# EAGLE design Alight_main_board_v2 (EAGLE 7.6.0)
CNAME: Alarm Light Main board / Juraj Repcik; CREVISION: 02

## Sheet 1 of 3
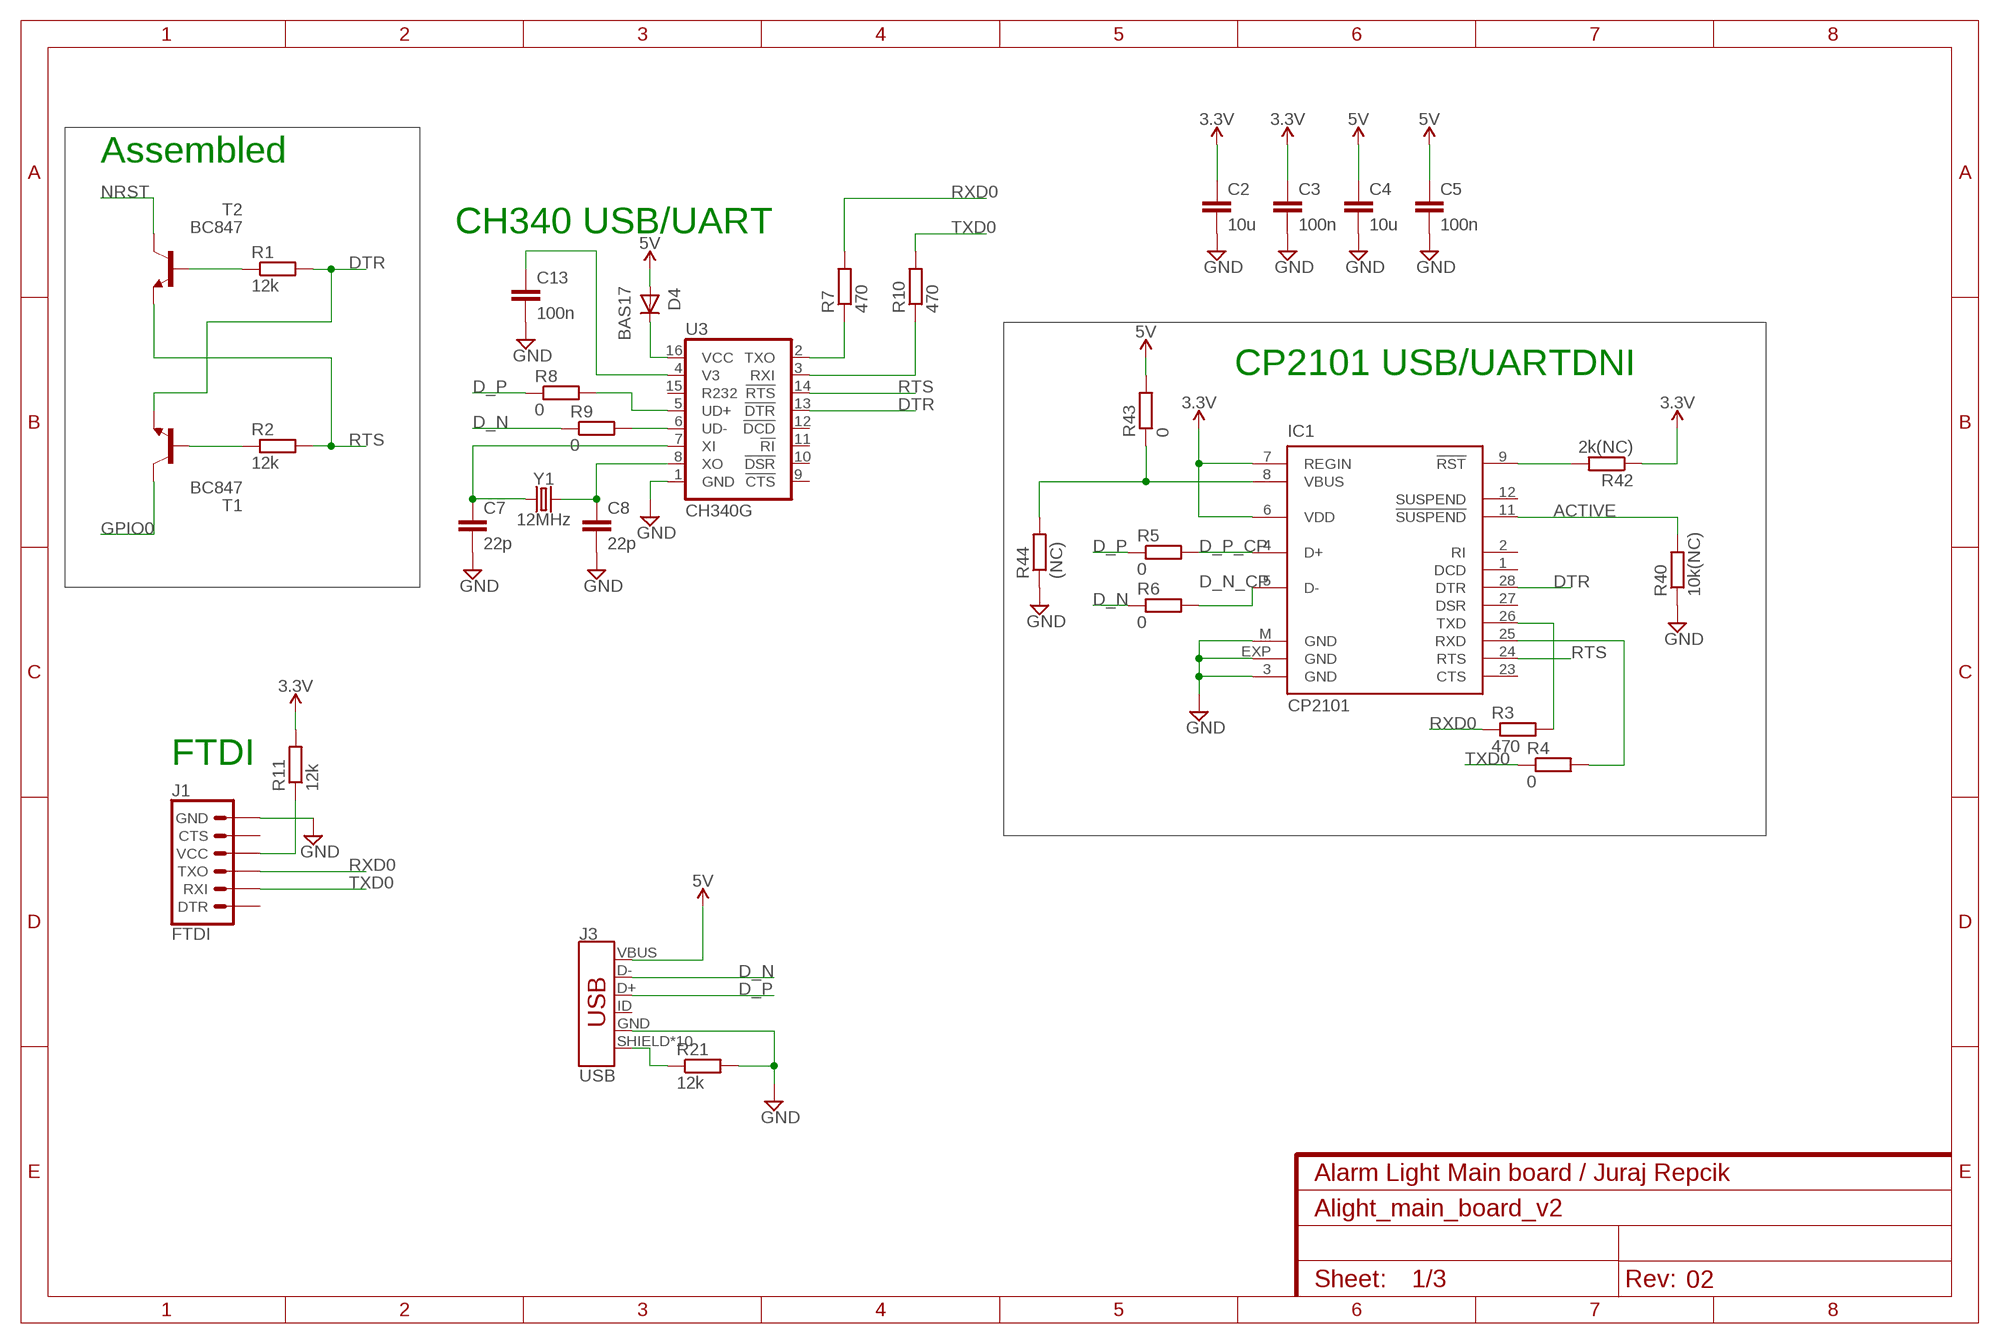
[diagram p0: schematic, sheet 1]

### Parts
C2  10u  C-EUC0603K  [C0603K]
C3  100n  C-EUC0603K  [C0603K]
C4  10u  C-EUC0603K  [C0603K]
C5  100n  C-EUC0603K  [C0603K]
C7  22p  C-EUC0402  [C0402]
C8  22p  C-EUC0402  [C0402]
C13  100n  C-EUC0603K  [C0603K]
D4  BAS17  [SOT23]
IC1  CP2101  CP210X_USB_UART  [MLP28]
J1  FTDI  6_PIN_SERIAL_TARGETLONGPADS  [1X06_LONGPADS]
J3  USB  USB_MICRO-B_HALF_PTH_MILL  [USB-MICROB-PTH-MILL]
R1  12k  R-EU_R0603  [R0603]
R2  12k  R-EU_R0603  [R0603]
R3  470  R-EU_R0603  [R0603]
R4  0  R-EU_R0603  [R0603]
R5  0  R-EU_R0603  [R0603]
R6  0  R-EU_R0603  [R0603]
R7  470  R-EU_R0603  [R0603]
R8  0  R-EU_R0603  [R0603]
R9  0  R-EU_R0603  [R0603]
R10  470  R-EU_R0603  [R0603]
R11  12k  R-EU_R0603  [R0603]
R21  12k  R-EU_R0603  [R0603]
R40  10k(NC)  R-EU_R0603  [R0603]
R42  2k(NC)  R-EU_R0603  [R0603]
R43  0  R-EU_R0603  [R0603]
R44  (NC)  R-EU_R0603  [R0603]
T1  BC847  [SOT23]
T2  BC847  [SOT23]
U3  CH340G  CH340GSMD  [SO016]
Y1  12MHz  CRYSTALSMD-HC49UP  [HC49UP]

### Nets
3.3V: C2.1 C3.1 IC1.6(VDD) IC1.7(REGIN) R11.2 R42.1 ; also sheet 2,3
5V: C4.1 C5.1 D4.1(A) J3.VBUS R43.2 ; also sheet 2,3
ACTIVE: IC1.11(!SUSPEND) R40.2
D_N: J3.D- R6.1 R9.1
D_N_CP: IC1.5(D-) R6.2
D_P: J3.D+ R5.1 R8.1
D_P_CP: IC1.4(D+) R5.2
DTR: IC1.28(DTR) R1.2 T1.2(E) U3.13(!DTR)
GND: C2.2 C3.2 C4.2 C5.2 C7.2 C8.2 C13.2 IC1.3(GND) IC1.EXP(GND) IC1.M(GND) J1.6(GND) J3.GND R21.2 R40.1 R44.1 U3.1(GND) ; also sheet 2,3
GPIO0: T1.3(C) ; also sheet 2
N$1: R1.1 T2.1(B)
N$2: R2.1 T1.1(B)
N$4: R7.1 U3.2(TXO)
N$5: R10.1 U3.3(RXI)
N$6: R8.2 U3.5(UD+)
N$7: R9.2 U3.6(UD-)
N$8: C7.1 U3.7(XI) Y1.1
N$9: C13.1 U3.4(V3)
N$10: C8.1 U3.8(XO) Y1.2
N$11: J1.4(VCC) R11.1
N$15: D4.3(K) U3.16(VCC)
N$17: J3.SHIELD J3.SHIELD2(SHIELD) J3.SHIELD3(SHIELD) J3.SHIELD4(SHIELD) J3.SHIELD5(SHIELD) J3.SHIELD6(SHIELD) J3.SHIELD7(SHIELD) J3.SHIELD8(SHIELD) J3.SHIELD9(SHIELD) J3.SHIELD10(SHIELD) R21.1
N$38: IC1.9(!RST) R42.2
N$39: IC1.8(VBUS) R43.1 R44.2
NRST: T2.3(C) ; also sheet 2,3
RTS: IC1.24(RTS) R2.2 T2.2(E) U3.14(!RTS)
RXD0: J1.3(TXO) R3.1 R7.2 ; also sheet 2,3
RXD0_CP2101IN: IC1.26(TXD) R3.2
TXD0: J1.2(RXI) R4.1 R10.2 ; also sheet 2,3
TXD0_CP2101: IC1.25(RXD) R4.2
Unconnected: IC1.1(DCD) IC1.2(RI) IC1.12(SUSPEND) IC1.23(CTS) IC1.27(DSR) J1.1(DTR) J1.5(CTS) J3.ID U3.9(!CTS) U3.10(!DSR) U3.11(!RI) U3.12(!DCD) U3.15(R232)

### Notes on the sheet
- Assembled
- CH340 USB/UART
- CP2101 USB/UART | DNI
- FTDI

## Sheet 2 of 3
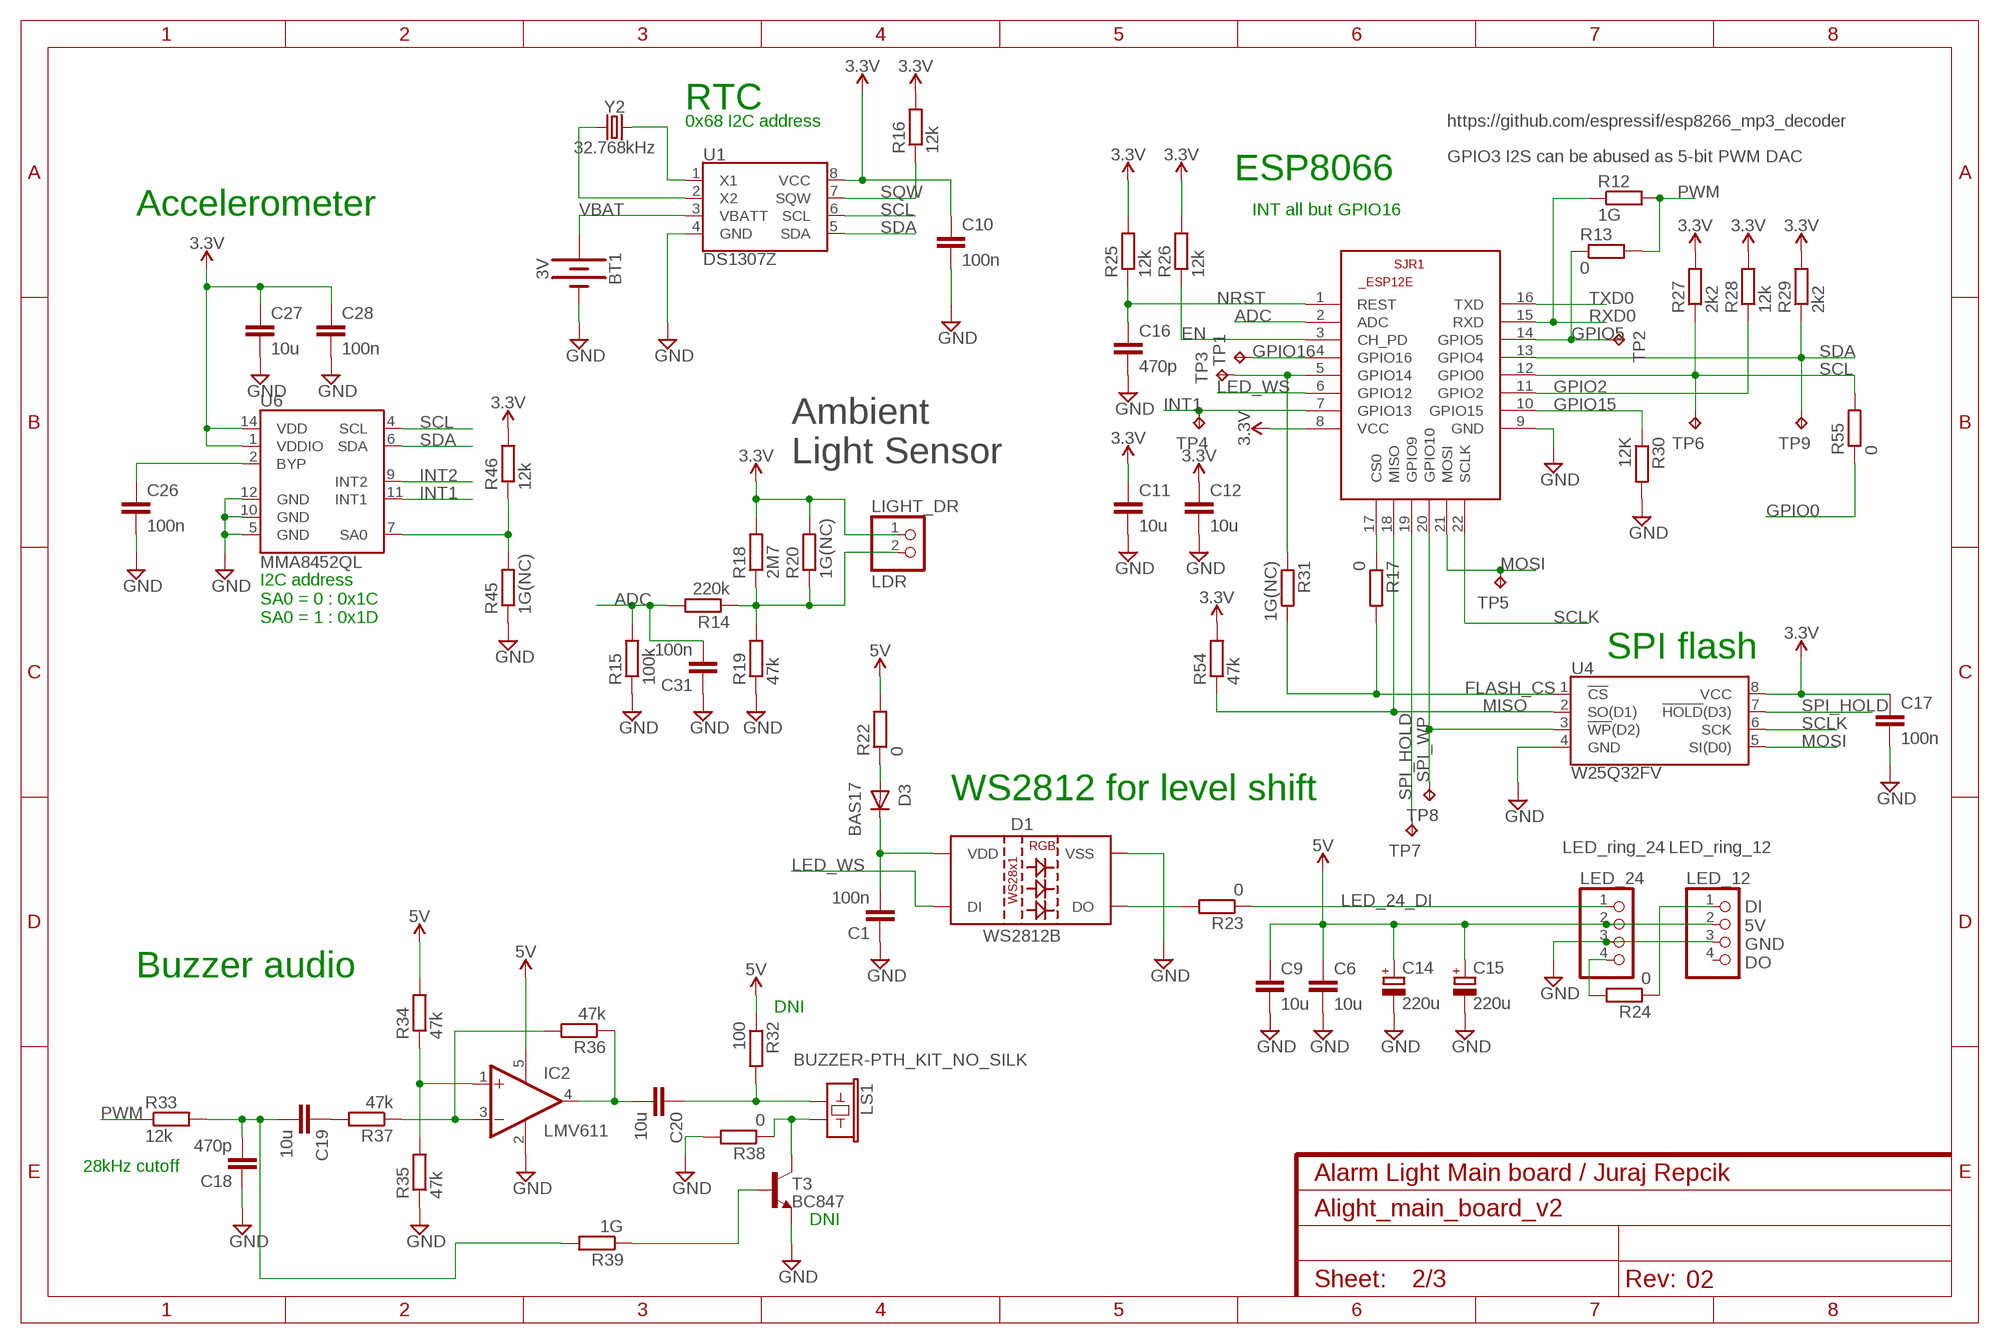
[diagram p1: schematic, sheet 2]

### Parts
BT1  3V  BATTERY-20MM_PTH_KIT  [BATTCOM_20MM_PTH_KIT]
C1  100n  C-EUC0603K  [C0603K]
C6  10u  C-EUC0603K  [C0603K]
C9  10u  C-EUC0603K  [C0603K]
C10  100n  C-EUC0603K  [C0603K]
C11  10u  C-EUC0603K  [C0603K]
C12  10u  C-EUC0603K  [C0603K]
C14  220u  CPOL-EU153CLV-0605  [153CLV-0605]
C15  220u  CPOL-EU153CLV-0605  [153CLV-0605]
C16  470p  C-EUC0603K  [C0603K]
C17  100n  C-EUC0603K  [C0603K]
C18  470p  C-EUC0603K  [C0603K]
C19  10u  C-EUC0603K  [C0603K]
C20  10u  C-EUC0603K  [C0603K]
C26  100n  C-EUC0603K  [C0603K]
C27  10u  C-EUC0603K  [C0603K]
C28  100n  C-EUC0603K  [C0603K]
C31  100n  C-EUC0603K  [C0603K]
D1  WS2812B  [WS2812B]
D3  BAS17  [SOT23]
IC2  LMV611  OPA333DCK  [SC70-5L]
LED_12  LED_ring_12  PINHD-1X4  [1X04]
LED_24  LED_ring_24  PINHD-1X4  [1X04]
LIGHT_DR  LDR  PINHD-1X2  [1X02]
LS1  BUZZER-PTH_KIT_NO_SILK  [BUZZER-12MM-NS-KIT]
R12  1G  R-EU_R0603  [R0603]
R13  0  R-EU_R0603  [R0603]
R14  220k  R-EU_R0603  [R0603]
R15  100k  R-EU_R0603  [R0603]
R16  12k  R-EU_R0603  [R0603]
R17  0  R-EU_R0603  [R0603]
R18  2M7  R-EU_R0603  [R0603]
R19  47k  R-EU_R0603  [R0603]
R20  1G(NC)  R-EU_R0603  [R0603]
R22  0  R-EU_R0603  [R0603]
R23  0  R-EU_R0603  [R0603]
R24  0  R-EU_R0603  [R0603]
R25  12k  R-EU_R0603  [R0603]
R26  12k  R-EU_R0603  [R0603]
R27  2k2  R-EU_R0603  [R0603]
R28  12k  R-EU_R0603  [R0603]
R29  2k2  R-EU_R0603  [R0603]
R30  12K  R-EU_R0603  [R0603]
R31  1G(NC)  R-EU_R0603  [R0603]
R32  100  R-EU_R0603  [R0603]
R33  12k  R-EU_R0603  [R0603]
R34  47k  R-EU_R0603  [R0603]
R35  47k  R-EU_R0603  [R0603]
R36  47k  R-EU_R0603  [R0603]
R37  47k  R-EU_R0603  [R0603]
R38  0  R-EU_R0603  [R0603]
R39  1G  R-EU_R0603  [R0603]
R45  1G(NC)  R-EU_R0603  [R0603]
R46  12k  R-EU_R0603  [R0603]
R54  47k  R-EU_R0603  [R0603]
R55  0  R-EU_R0603  [R0603]
SJR1  ESP12E/F  ESP8266-12EESP12E  [ESP8266-ESP12E]
T3  BC847  [SOT23]
TP1  TPTP10R  [TP10R]
TP2  TPTP10R  [TP10R]
TP3  TPTP10R  [TP10R]
TP4  TPTP10R  [TP10R]
TP5  TPTP10R  [TP10R]
TP6  TPTP10R  [TP10R]
TP7  TPTP10R  [TP10R]
TP8  TPTP10R  [TP10R]
TP9  TPTP10R  [TP10R]
U1  DS1307Z  [SO08-0.15]
U4  W25Q32FV  W25Q32FVSS  [SOIC-8]
U6  MMA8452QL  [QFN-16_0.5MM-EXTRA]
Y2  32.768kHz  CRYSTAL-32.768KHZSMD-3.2X1.5  [CRYSTAL-SMD-3.2X1.5MM]

### Nets
3.3V: C10.1 C11.1 C12.1 C17.1 C27.1 C28.1 LIGHT_DR.1 R16.2 R18.2 R20.2 R25.2 R26.2 R27.2 R28.2 R29.2 R46.2 R54.2 SJR1.8(VCC) U1.8(VCC) U4.8(VCC) U6.1(VDDIO) U6.14(VDD) ; also sheet 1,3
5V: C6.1 C9.1 C14.+ C15.+ IC2.5(V+) LED_12.2 LED_24.2 R22.2 R32.1 R34.2 ; also sheet 1,3
ADC: C31.2 R14.2 R15.2 SJR1.2(ADC) ; also sheet 3
EN: R26.1 SJR1.3(CH_PD)
FLASH_CS: R17.2 R31.2 U4.1(!CS!) ; also sheet 3
GND: BT1.2(-) C1.1 C6.2 C9.2 C10.2 C11.2 C12.2 C14.- C15.- C16.2 C17.2 C18.1 C26.2 C27.2 C28.2 C31.1 D1.3(VSS) IC2.2(V-) LED_12.3 LED_24.3 R15.1 R19.1 R30.2 R35.1 R38.2 R45.1 SJR1.9(GND) T3.2(E) U1.4(GND) U4.4(GND) U6.5(GND) U6.10(GND) U6.12(GND) ; also sheet 1,3
GPIO0: R55.1 ; also sheet 1
GPIO2: R28.1 SJR1.11(GPIO2) ; also sheet 3
GPIO5: R13.1 SJR1.14(GPIO5) TP2.TP
GPIO15: R30.1 SJR1.10(GPIO15)
GPIO16: SJR1.4(GPIO16) TP1.TP
INT1: SJR1.7(GPIO13) TP4.TP U6.11(INT1) ; also sheet 3
INT2: U6.9(INT2) ; also sheet 3
LED_12DI: LED_12.1 R24.1
LED_24_DI: LED_24.1 R23.1
LED_24_DO: LED_24.4 R24.2
LED_WS: D1.4(DI) SJR1.6(GPIO12) ; also sheet 3
MISO: R54.1 SJR1.18(MISO) U4.2(SO(D1))
MOSI: SJR1.21(MOSI) TP5.TP U4.5(SI(D0))
N$3: C1.2 D1.1(VDD) D3.3(K)
N$14: LIGHT_DR.2 R14.1 R18.1 R19.2 R20.1
N$16: D3.1(A) R22.1
N$18: D1.2(DO) R23.2
N$19: C26.1 U6.2(BYP)
N$21: R31.1 SJR1.5(GPIO14) TP3.TP
N$22: R17.1 SJR1.17(CS0)
N$25: LS1.- R38.1 T3.3(C)
N$26: R39.1 T3.1(B)
N$28: IC2.1(+IN) R34.1 R35.2
N$30: U1.1(X1) Y2.P$2
N$31: U1.2(X2) Y2.P$1
N$32: IC2.3(-IN) R36.2 R37.1
N$33: C20.1 LS1.+ R32.2
N$34: C19.1 R37.2
N$35: C20.2 IC2.4(OUT) R36.1
N$36: C18.2 C19.2 R33.2 R39.2
N$40: R45.2 R46.1 U6.7(SA0)
NRST: C16.1 R25.1 SJR1.1(REST) ; also sheet 1,3
PWM: R12.2 R13.2 R33.1 ; also sheet 3
RXD0: R12.1 SJR1.15(RXD) ; also sheet 1,3
SCL: R27.1 R55.2 SJR1.12(GPIO0) TP6.TP U1.6(SCL) U6.4(SCL) ; also sheet 3
SCLK: SJR1.22(SCLK) U4.6(SCK)
SDA: R29.1 SJR1.13(GPIO4) TP9.TP U1.5(SDA) U6.6(SDA) ; also sheet 3
SPI_HOLD: SJR1.19(GPIO9) TP7.TP U4.7(!HOLD!(D3))
SPI_WP: SJR1.20(GPIO10) TP8.TP U4.3(!WP!(D2))
SQW: R16.1 U1.7(SQW)
TXD0: SJR1.16(TXD) ; also sheet 1,3
VBAT: BT1.1(+) U1.3(VBATT)
Unconnected: LED_12.4

### Notes on the sheet
- RTC
- 0x68 I2C address | https://github.com/espressif/esp8266_mp3_decoder
- GPIO3 I2S can be abused as 5-bit PWM DAC
- ESP8066
- Accelerometer | INT all but GPIO16
- Ambient
  Light Sensor
- I2C address
  SA0 = 0 : 0x1C
  SA0 = 1 : 0x1D
- SPI flash
- WS2812 for level shift
- DI
  5V
  GND
  DO
- Buzzer audio
- DNI
- 28kHz cutoff
- DNI

## Sheet 3 of 3
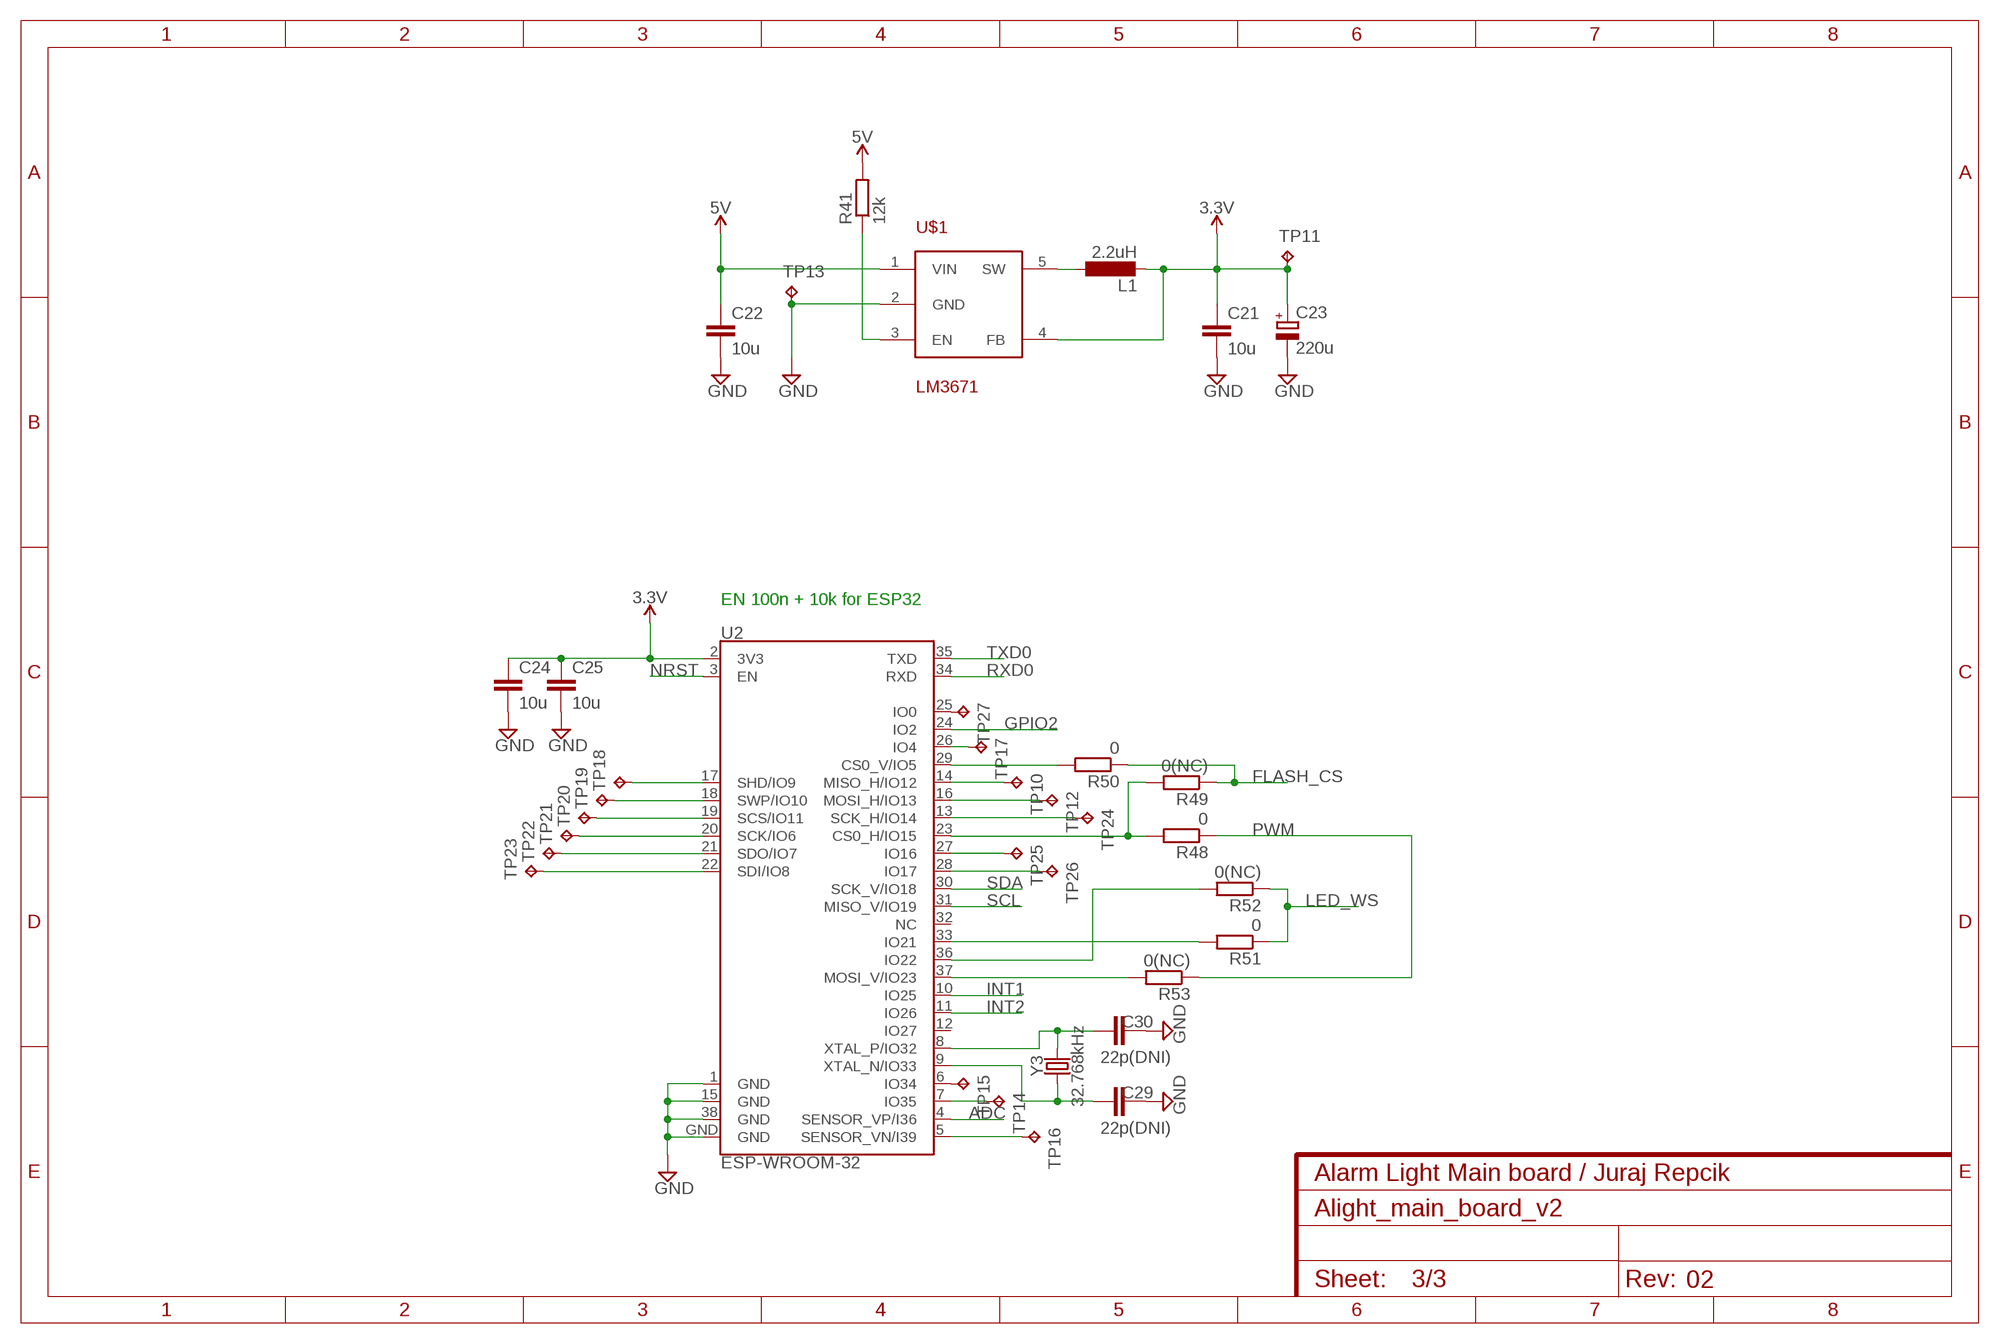
[diagram p2: schematic, sheet 3]

### Parts
C21  10u  C-EUC0603K  [C0603K]
C22  10u  C-EUC0603K  [C0603K]
C23  220u  CPOL-EU153CLV-0605  [153CLV-0605]
C24  10u  C-EUC0603K  [C0603K]
C25  10u  C-EUC0603K  [C0603K]
C29  22p(DNI)  C-EUC0402  [C0402]
C30  22p(DNI)  C-EUC0402  [C0402]
L1  2.2uH  L-EUL3225M  [L3225M]
R41  12k  R-EU_R0603  [R0603]
R48  0  R-EU_R0603  [R0603]
R49  0(NC)  R-EU_R0603  [R0603]
R50  0  R-EU_R0603  [R0603]
R51  0  R-EU_R0603  [R0603]
R52  0(NC)  R-EU_R0603  [R0603]
R53  0(NC)  R-EU_R0603  [R0603]
TP10  TPTP10R  [TP10R]
TP11  TPTP10R  [TP10R]
TP12  TPTP10R  [TP10R]
TP13  TPTP10R  [TP10R]
TP14  TPTP10R  [TP10R]
TP15  TPTP10R  [TP10R]
TP16  TPTP10R  [TP10R]
TP17  TPTP10R  [TP10R]
TP18  TPTP10R  [TP10R]
TP19  TPTP10R  [TP10R]
TP20  TPTP10R  [TP10R]
TP21  TPTP10R  [TP10R]
TP22  TPTP10R  [TP10R]
TP23  TPTP10R  [TP10R]
TP24  TPTP10R  [TP10R]
TP25  TPTP10R  [TP10R]
TP26  TPTP10R  [TP10R]
TP27  TPTP10R  [TP10R]
U2  ESP-WROOM-32  [ESP-WROOM-32]
U$1  LM3671  [SOT23-5]
Y3  32.768kHz  CRYSTAL-32.768KHZSMD-3.2X1.5  [CRYSTAL-SMD-3.2X1.5MM]

### Nets
3.3V: C21.1 C23.+ C24.1 C25.1 L1.2 TP11.TP U2.2(3V3) U$1.4(FB) ; also sheet 1,2
5V: C22.1 R41.2 U$1.1(VIN) ; also sheet 1,2
ADC: U2.4(SENSOR_VP/I36) ; also sheet 2
FLASH_CS: R49.1 R50.1 ; also sheet 2
GND: C21.2 C22.2 C23.- C24.2 C25.2 C29.2 C30.2 TP13.TP U2.1(GND) U2.15(GND) U2.38(GND) U2.GND U$1.2(GND) ; also sheet 1,2
GPIO2: U2.24(IO2) ; also sheet 2
INT1: U2.10(IO25) ; also sheet 2
INT2: U2.11(IO26) ; also sheet 2
LED_WS: R51.1 R52.1 ; also sheet 2
N$12: C30.1 U2.8(XTAL_P/IO32) Y3.P$2
N$13: C29.1 U2.9(XTAL_N/IO33) Y3.P$1
N$20: R48.2 R49.2 U2.23(CS0_H/IO15)
N$23: R51.2 U2.33(IO21)
N$24: R52.2 U2.36(IO22)
N$27: R41.1 U$1.3(EN)
N$37: L1.1 U$1.5(SW)
N$41: R50.2 U2.29(CS0_V/IO5)
N$42: R53.2 U2.37(MOSI_V/IO23)
N$43: TP14.TP U2.7(IO35)
N$44: TP15.TP U2.6(IO34)
N$45: TP16.TP U2.5(SENSOR_VN/I39)
N$46: TP17.TP U2.26(IO4)
N$47: TP18.TP U2.17(SHD/IO9)
N$48: TP19.TP U2.18(SWP/IO10)
N$49: TP20.TP U2.19(SCS/IO11)
N$50: TP21.TP U2.20(SCK/IO6)
N$51: TP22.TP U2.21(SDO/IO7)
N$52: TP23.TP U2.22(SDI/IO8)
N$63: TP10.TP U2.14(MISO_H/IO12)
N$64: TP12.TP U2.16(MOSI_H/IO13)
N$65: TP24.TP U2.13(SCK_H/IO14)
N$66: TP25.TP U2.27(IO16)
N$67: TP26.TP U2.28(IO17)
N$68: TP27.TP U2.25(IO0)
NRST: U2.3(EN) ; also sheet 1,2
PWM: R48.1 R53.1 ; also sheet 2
RXD0: U2.34(RXD) ; also sheet 1,2
SCL: U2.31(MISO_V/IO19) ; also sheet 2
SDA: U2.30(SCK_V/IO18) ; also sheet 2
TXD0: U2.35(TXD) ; also sheet 1,2
Unconnected: U2.12(IO27) U2.32(NC)

### Notes on the sheet
- EN 100n + 10k for ESP32

## Library data of the parts
BT1 = SparkFun-Batteries:BATTERY: Battery - Single Cell A variety of battery chemistries, sizes, and footprints. Device List: 20MM_PTH - Coin Cell Battery Holder - 20mm (PTH) <https://www.sparkfun.com/products/783> 20MM_PTH_KIT- Coin Cell battery Holder - 20 mm (PTH) <http://www.sparkfun.com/products/783>kit version with special mask 6.8MM_PTH - Coin Cell Battery Holder - 6.8MM(SMD) <https://www.digikey.com/product-detail/en/seiko-instruments/MS621FE-FL11E/728-1057-ND/1889208?WT.srch=1&gclid=CNOQ5a6LzdQCFZS2wAodXCkE0g> 12MM_SMD - Coin Cell Battery Holder - 12mm (SMD) <https://www.sparkfun.com/products/10592> 12MM_PTH - Coin Cell Battery Holder - 12mm (PTH) <https://www.sparkfun.com/products/7948> 20MM_SMD - 20mm Coin Cell Battery Holder (SMD) (2 legs) Used on the Big Time Watch Kit <https://www.sparkfun.com/products/11734> 20MM_SMD_4LEGS - Coin Cell Battery Holder - 20mm (SMD) <https://www.sparkfun.com/products/11892> 20MM_SMD_4LEGS_OVERPASTE - Coin Cell Battery Holder - 20mm (SMD) <https://www.sparkfun.com/products/11892> (Over-paste on the legs) 24.5MM_PTH - Coin Cell Battery Holder - 24.5mm (PTH) <https://www.sparkfun.com/products/8863> 9V - 9V Battery Holder - PC Mount Used on the SparkFun SparkPunk Sound Kit <https://www.sparkfun.com/products/11177> and SparkFun SparkPunk Sequencer Kit <https://www.sparkfun.com/products/12707> 18650 - Battery Holder - 18650 (PTH) <https://www.sparkfun.com/products/13113> AA - Battery Holder - 1xAA (PTH) <https://www.sparkfun.com/products/7949> AAA - Battery Holder - 1xAAA (PTH) <https://www.sparkfun.com/products/12718> AA_KIT - Battery Holder - 1xAA (PTH) <https://www.sparkfun.com/products/7949> Special kit package - pads only have exposed copper on one side of the board. AAA_KIT - Battery Holder - 1xAAA (PTH) <https://www.sparkfun.com/products/12718> Special kit package - pads only have exposed copper on one side of the board.
C1-C13 C16-C22 C24-C31 = resistor:C-EU: CAPACITOR, European symbol
C14 C15 C23 = resistor:CPOL-EU: POLARIZED CAPACITOR, European symbol
D1 = SparkFun-LED:WS2812B: WS2812B SMD addressable RGB LED 5x5mm SMD LED with built-in controller IC. Color: Red/Green/Blue mC Rating: RGB: 390, 660, 180 mcd Forward Voltage: RGB: 2.0, 3.0, 3.0 V Packages:WS2812B SparkFun Products: Blynk Board - ESP8266 <https://www.sparkfun.com/products/13794>; PROD_ID: DIO-12503
D3 D4 = nxp_60:BAS17: Low-voltage stabistor Low-voltage stabilization diode in a small SOT23 plastic package. AAL Eindhoven MK
IC1 = SparkFun-Retired:CP210X_USB_UART: Single-Chip USB to UART Bridge Source: www.silabs.com .. CP2101.pdf / cp2102.pdf. Spark Fun Electronics SKU : COM-00310 RETIRED: IC-00865; PROD_ID: COM-00310
IC2 = linear:OPA333: 1.8V, microPOWER CMOS OPERATIONAL AMPLIFIERS Zerø-Drift Series Source: Texas Instruments (Burr-Brown) .. U11 opa333 Operational Amp.pdf
J1 = SparkFun-Connectors:6_PIN_SERIAL_TARGET: 6-pin header connection for use with the "FTDI BASIC" pinout - TARGET SIDE. Also known as "Arduino Serial Program Header". It is used to mate with our FTDI Basic serial programmers using the Arduino IDE. Note, this device has "TARGET" in the name. It is intended to be used on a design that contains a target micro-controller that you wish to program. The "sister" device, named "CABLE" is inteneded to be used on a design that usually lives on the end of your USB cable and prvides the converter chip (FTDI232 or FTDI231x) to commnicate serial RX/TX. You can populate with some of these: Break Away Headers - Straight <https://www.sparkfun.com/products/116> (PRT-00116) For reference (or to suit your programming needs) check out these designs: SparkFun FTDI Basic Breakout - 5V <https://www.sparkfun.com/products/9716> (DEV-09716) SparkFun FTDI Basic Breakout - 3.3V <https://www.sparkfun.com/products/9873> (DEV-09873) SparkFun FTDI SmartBasic <https://www.sparkfun.com/products/12935> (DEV-12935) SparkFun Beefy 3 - FTDI Basic Breakout <https://www.sparkfun.com/products/13746> (DEV-13746)
J3 = SparkFun-Connectors:USB_MICRO-B: USB Type Micro-B Connector Male/female and PTH/SMT variants SparkFun Products: SparkFun microB USB Breakout <https://www.sparkfun.com/products/12035> SparkFun USB microB Plug Breakout <https://www.sparkfun.com/products/10031> SparkFun ESP8266 Thing <https://www.sparkfun.com/products/13231>; PROD_ID: CONN-13711
L1 = resistor:L-EU: INDUCTOR, European symbol
LED_12 LED_24 = pinhead:PINHD-1X4: PIN HEADER
LIGHT_DR = pinhead:PINHD-1X2: PIN HEADER
LS1 = SparkFun-Electromechanical:BUZZER: Buzzer Small round buzzers that operate around the audible 2kHz range. You can use these as speakers to create simple music or user interfaces. Variant Overview: PTH - Mini Speaker - PC Mount 12mm 2.048kHz <https://www.sparkfun.com/products/7950> PTH_KIT - Mini Speaker - PC Mount 12mm 2.048kHz <https://www.sparkfun.com/products/7950> KIT simplifies soldering by adding stop mask to one side of the pads. PTH_NO_SILK - Mini Speaker - PC Mount 12mm 2.048kHz <https://www.sparkfun.com/products/7950> No silkscreen indicator of buzzer outline. PTH_KIT_NO_SILK - Mini Speaker - PC Mount 12mm 2.048kHz <https://www.sparkfun.com/products/7950> KIT package w/o silkscreen SMD - Buzzer Audio Magnetic (CCV-084B16) SMD buzzer used on, e.g. the LilyPad Buzzer <https://www.sparkfun.com/products/8463> and RFID USB Reader <https://www.sparkfun.com/products/9963>. SMD_KIT - Buzzer Audio Magnetic (CCV-084B16) SMD Buzzer with elongated pins to make soldering easier. Used on the SparkFun Simon Says - Surface Mount Soldering Kit <https://www.sparkfun.com/products/10935>.; PROD_ID: COMP-08253; SF_SKU: COM-07950
R1-R46 R48-R55 = resistor:R-EU_: RESISTOR, European symbol
SJR1 = esp12e:ESP8266-12E: ESP8266-12E Library for Eagle CAD The author not responsible for any damages or errors!. Created by Suhail jr.lt;/author>
T1 T2 = transistor-neu-to92:BC847: NPN TRANSISTOR
T3 = nxp_60:BC847: 45 V, 100 mA NPN general-purpose transistors NPN general-purpose transistor AAL Eindhoven MK
TP1-TP27 = testpad:TP: Test pad
U1 = SparkFun-Clocks:DS1307: Maxim DS1307 - I2C Real-time clock (RTC) The DS1307 serial real-time clock (RTC) is a low-power, full binary-coded decimal (BCD) clock/calendar plus 56 bytes of NV SRAM. Address and data are transferred serially through an I2C, bidirectional bus. The clock/calendar provides seconds, minutes, hours, day, date, month, and year information. SparkFun Products: Real Time Clock Module <https://www.sparkfun.com/products/12708> (BOB-12708) Datasheet <https://cdn.sparkfun.com/datasheets/BreakoutBoards/DS1307.pdf>; PROD_ID: IC-08138
U2 = SparkFun-RF:ESP-WROOM-32; PROD_ID: IC-13849
U3 = SparkFun-IC-Comms:CH340G: A simple USB 2.0 to Serial IC.; PROD_ID: IC-13498
U4 = SparkFun-IC-Memory:W25Q32FV: W25Q32FV 32Mb (4MB) Serial Flash Memory The W25Q32FV support the standard Serial Peripheral Interface (SPI), Dual/Quad I/O SPI as well as 2-clocks instruction cycle Quad Peripheral Interface (QPI). 104MHz, SPI, 8-SOIC-EIAJ Datasheet <http://www.winbond.com/resource-files/w25q32fv%20revh%20091613.pdf> SparkFun Products SparkFun Blynk Board - ESP8266 <https://www.sparkfun.com/products/13794> (WRL-13794); PROD_ID: IC-13229
U6 = MMA8452Q:MMA8452Q: MMA8452Q 3-Axis, 12/8-bit Digital Accelerometer Supply Voltage: 1.6-3.6V Range: +/- 2g, 4g, 8g Interface: I2C, 12-bit and 8-bit ODR: 1.56 Hz - 800 Hz Package: QFN-16 http://cache.freescale.com/files/sensors/doc/data_sheet/MMA8452Q.pdf; AVAILABILITY: Unavailable; DESCRIPTION: Sensor: accelerometer; Range: 2/4/8g; -40÷85°C; 1.95÷3.6V; MF: NXP Semiconductors; MP: MMA8452Q; PACKAGE: None; PRICE: None
U$1 = texas-custom:LM3671: Texas Instruments LM3671, LM3671Q 2MHz, 600mA Step-Down DC-DC Converter
Y1 = SparkFun-Clocks:CRYSTAL: Crystals (Generic) These are passive quartz crystals, which can be used as a clock source for a microcontroller. Crystal's are two-terminal devices. They require external "load" capacitors to generate an oscillating signal.
Y2 Y3 = SparkFun-Clocks:CRYSTAL-32.768KHZ: 32.768kHz Crystal Frequency: 32.768kHz Frequency Stability: ±20ppm Load Capacitance: 12.5pF (PTH-2X6 & SMD-3.2X1.5), 6pF (SMD-2X6) SparkFun Products: SparkFun BigTime Watch Kit <https://www.sparkfun.com/products/11734> SparkFun nRF52832 Breakout <https://www.sparkfun.com/products/13990> SparkFun Real Time Clock Module <https://www.sparkfun.com/products/12708>; PROD_ID: XTAL-13062

## Board
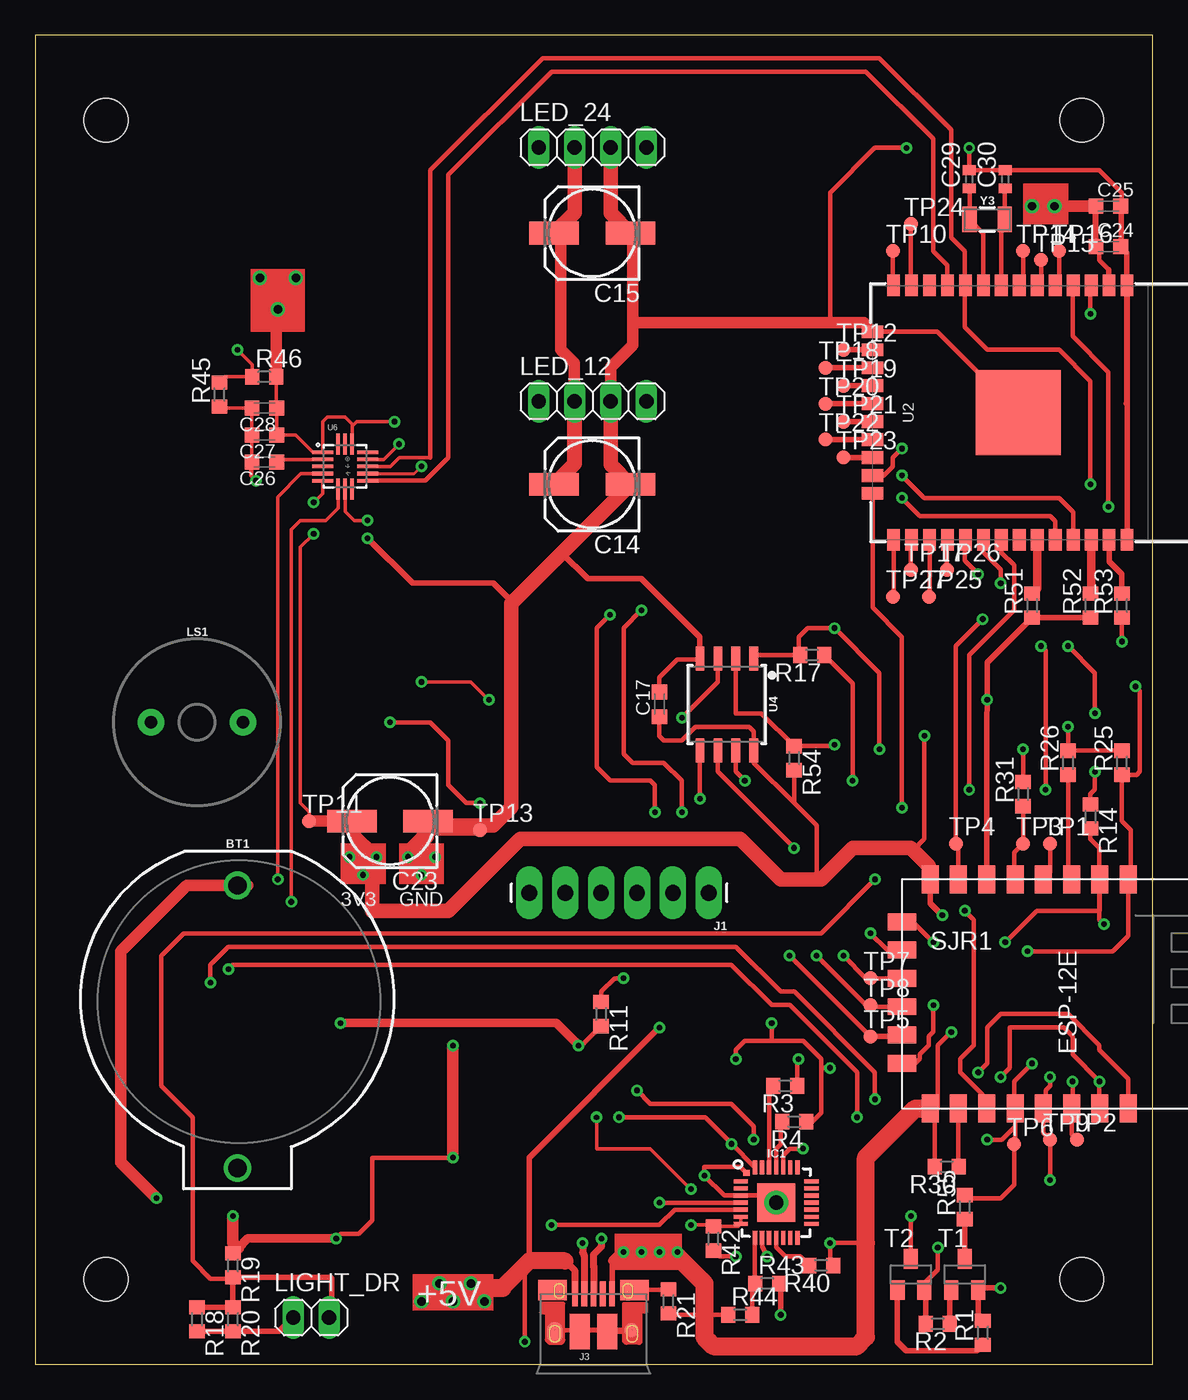
[diagram p3: board, top side]
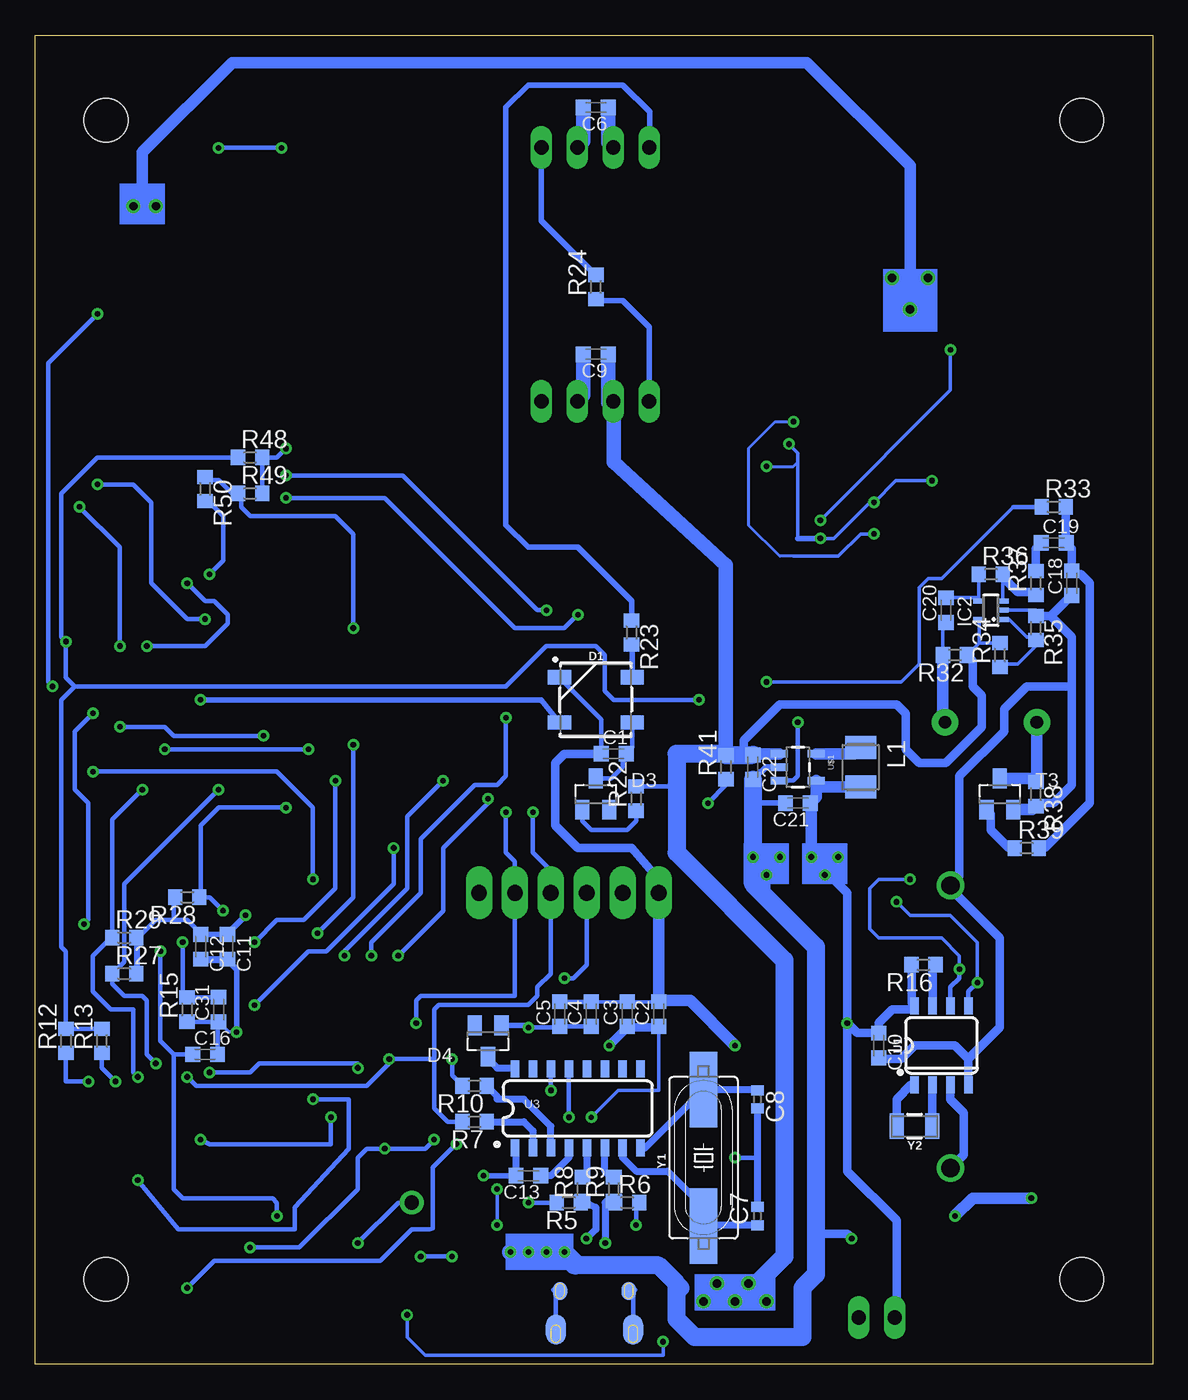
[diagram p4: board, bottom side, seen from below]

Size 79 x 94 mm. Coordinates in mm from the lower left corner, seen from the top.
Outline: 0,0 79,0 79,94 0,94 0,0
Copper layers (1*16): Top 0.035mm / dielectric 1.5mm / Bottom 0.035mm
Design rules "default *": minimum track width 8mil, minimum drill 15mil, track to track 8mil, track to pad 8mil, pad to pad 8mil, via to via 12mil, smd to smd 8mil, copper to edge 40mil, drill to drill 12mil, minimum pad ring 10mil, minimum via ring 8mil, stop-mask expansion 4mil, vias tented up to drill 0mil, thermal gap 10mil
Holes 3.1 mm at 5,6 5,88 74,88 74,6

### Footprints (pad centres in the part's own frame; a part is rotated, then mirrored left to right if it is on the bottom)
BATTCOM_20MM_PTH_KIT = drill 1.3: 1 11.85,0; 2 -8.15,0
C0603K = smd 1.05 x 1.08: 1 -0.875,0; 2 0.875,0
C0402 = smd 0.7 x 0.9: 1 -0.65,0; 2 0.65,0
153CLV-0605 = smd 3.5 x 1.6: + 2.7,0; - -2.7,0
WS2812B = smd 1.651 x 1: 1 2.577,-1.6; 2 2.577,1.6; 3 -2.577,1.6; 4 -2.577,-1.6
SOT23 = smd 1 x 1.4: 1 -0.95,-1.1; 2 0.95,-1.1; 3 0,1.1
MLP28 = smd 1 x 0.3: 1 -2.5,1.5; 2 -2.5,1; 3 -2.5,0.5; 4 -2.5,0; 5 -2.5,-0.5; 6 -2.5,-1; 7 -2.5,-1.5; 15 2.5,-1.5; 16 2.5,-1; 17 2.5,-0.5; 18 2.5,0; 19 2.5,0.5; 20 2.5,1; 21 2.5,1.5 | smd 0.3 x 1: 8 -1.5,-2.5; 9 -1,-2.5; 10 -0.5,-2.5; 11 0,-2.5; 12 0.5,-2.5; 13 1,-2.5; 14 1.5,-2.5; 22 1.5,2.5; 23 1,2.5; 24 0.5,2.5; 25 0,2.5; 26 -0.5,2.5; 27 -1,2.5; 28 -1.5,2.5 | smd 2.7 x 2.7: EXP 0,0 | smd 0.435 x 0.435: M -2.103,2.103
SC70-5L = smd 0.35 x 0.8: 1 -0.65,-0.85; 2 0,-0.85; 3 0.65,-0.85; 4 0.65,0.85; 5 -0.65,0.85
1X06_LONGPADS = drill 1.118 pad 1.88 long: 1 0,0; 2 2.54,0; 3 5.08,0; 4 7.62,0; 5 10.16,0; 6 12.7,0
USB-MICROB-PTH-MILL = smd 0.4 x 1.75: D+ 0,0; D- -0.65,0; GND 1.3,0; ID 0.65,0; VBUS -1.3,0 | smd 2 x 1.46: SHIELD -2.9,0.275; SHIELD2 2.9,0.275 | smd 1.425 x 2.5: SHIELD3 -0.963,-2.675; SHIELD4 0.963,-2.675 | smd 1.4 x 2.1 bottom: SHIELD5 -2.731,-2.531; SHIELD7 2.729,-2.531 | smd 1 x 1: SHIELD6 2.7,-2.575 | smd 1.1 x 1.5: SHIELD8 -2.731,-2.731 | smd 1 x 1.3 bottom: SHIELD9 -2.43,0.195; SHIELD10 2.43,0.195
L3225M = smd 1.6 x 2.2: 1 -1.4,0; 2 1.4,0
1X04 = drill 1.016 long: 1 -3.81,0; 2 -1.27,0; 3 1.27,0; 4 3.81,0
1X02 = drill 1.016 long: 1 -1.27,0; 2 1.27,0
BUZZER-12MM-NS-KIT = drill 0.9 pad 1.88: + 3.25,0; - -3.25,0
R0603 = smd 1 x 1.1: 1 -0.85,0; 2 0.85,0
ESP8266-ESP12E = smd 2 x 1.2: 1 -7.62,5.84; 2 -7.62,3.84; 3 -7.62,1.84; 4 -7.62,-0.16; 5 -7.62,-2.16; 6 -7.62,-4.16; 7 -7.62,-6.16; 8 -7.62,-8.16; 9 8.58,-8.16; 10 8.58,-6.16; 11 8.58,-4.16; 12 8.58,-2.16; 13 8.58,-0.16; 14 8.58,1.84; 15 8.58,3.84; 16 8.58,5.84 | smd 1.2 x 2: 17 -4.62,-10.16; 18 -2.62,-10.16; 19 -0.62,-10.16; 20 1.38,-10.16; 21 3.38,-10.16; 22 5.38,-10.16
TP10R = smd 1 x 1: TP 0,0
SO08-0.15 = smd 0.6 x 1.2: 1 -1.905,-2.8; 2 -0.635,-2.8; 3 0.635,-2.8; 4 1.905,-2.8; 5 1.905,2.8; 6 0.635,2.8; 7 -0.635,2.8; 8 -1.905,2.8
ESP-WROOM-32 = smd 0.9 x 1.5: 1 7.7,9; 2 6.43,9; 3 5.16,9; 4 3.89,9; 5 2.62,9; 6 1.35,9; 7 0.08,9; 8 -1.19,9; 9 -2.46,9; 10 -3.73,9; 11 -5,9; 12 -6.27,9; 13 -7.54,9; 14 -8.81,9; 25 -8.81,-9; 26 -7.54,-9; 27 -6.27,-9; 28 -5,-9; 29 -3.73,-9; 30 -2.46,-9; 31 -1.19,-9; 32 0.08,-9; 33 1.35,-9; 34 2.62,-9; 35 3.89,-9; 36 5.16,-9; 37 6.43,-9; 38 7.7,-9 | smd 1.5 x 0.9: 15 -10.3,5.715; 16 -10.3,4.445; 17 -10.3,3.175; 18 -10.3,1.905; 19 -10.3,0.635; 20 -10.3,-0.635; 21 -10.3,-1.905; 22 -10.3,-3.175; 23 -10.3,-4.445; 24 -10.3,-5.715 | smd 6 x 6: GND 0,0
SO016 = smd 0.6 x 1.2: 1 -4.445,-2.8; 2 -3.175,-2.8; 3 -1.905,-2.8; 4 -0.635,-2.8; 5 0.635,-2.8; 6 1.905,-2.8; 7 3.175,-2.8; 8 4.445,-2.8; 9 4.445,2.8; 10 3.175,2.8; 11 1.905,2.8; 12 0.635,2.8; 13 -0.635,2.8; 14 -1.905,2.8; 15 -3.175,2.8; 16 -4.445,2.8
SOIC-8 = smd 0.61 x 1.702: 1 -1.905,-3.251; 2 -0.635,-3.251; 3 0.635,-3.251; 4 1.905,-3.251; 5 1.905,3.251; 6 0.635,3.251; 7 -0.635,3.251; 8 -1.905,3.251
QFN-16_0.5MM-EXTRA = smd 1.5 x 0.25: 1 -1.59,1; 2 -1.59,0.5; 3 -1.59,0; 4 -1.59,-0.5; 5 -1.59,-1; 9 1.59,-1; 10 1.59,-0.5; 11 1.59,0; 12 1.59,0.5; 13 1.59,1 | smd 0.25 x 1.5: 6 -0.5,-1.59; 7 0,-1.59; 8 0.5,-1.59; 14 0.5,1.59; 15 0,1.59; 16 -0.5,1.59
SOT23-5 = smd 0.55 x 1.2: 1 -0.95,-1.3; 2 0,-1.3; 3 0.95,-1.3; 4 0.95,1.3; 5 -0.95,1.3
HC49UP = smd 5.334 x 1.93: 1 -4.826,0; 2 4.826,0
CRYSTAL-SMD-3.2X1.5MM = smd 1 x 1.8: P$1 -1.25,0; P$2 1.25,0

### Placement (x,y rotation side)
BT1  14.29,25.72 270 top
C1  38.1,43.18 0 bottom
C2  34.92,24.77 90 bottom
C3  37.15,24.77 90 bottom
C4  39.69,24.77 90 bottom
C5  41.91,24.77 90 bottom
C6  39.37,88.9 180 bottom
C7  27.94,10.48 90 bottom
C8  27.94,18.73 270 bottom
C9  39.37,71.44 180 bottom
C10  19.37,22.54 270 bottom
C11  65.41,29.53 270 bottom
C12  67.31,29.53 270 bottom
C13  44.13,13.34 180 bottom
C14  39.37,62.23 180 top
C15  39.37,80.01 180 top
C16  66.99,21.91 0 bottom
C17  44.13,46.67 90 top
C18  5.71,55.24 90 bottom
C19  6.99,58.1 0 bottom
C20  14.61,53.34 90 bottom
C21  25.08,39.69 180 bottom
C22  28.26,42.23 270 bottom
C23  25.08,38.42 180 top
C24  75.88,79.06 0 top
C25  75.88,81.92 0 top
C26  16.19,63.82 180 top
C27  16.19,65.72 180 top
C28  16.19,67.63 180 top
C29  66.04,83.82 90 top
C30  68.58,83.82 90 top
C31  66.04,25.08 90 bottom
D1  39.37,46.99 0 bottom
D3  39.37,40.32 0 bottom
D4  46.99,22.86 180 bottom
IC1  52.39,11.43 0 top
IC2  11.43,53.34 90 bottom
J1  47.62,33.34 180 top
J3  39.47,4.97 0 top
L1  20.64,42.23 270 bottom
LED_12  39.4,68.11 0 top
LED_24  39.4,86.08 0 top
LIGHT_DR  19.5,3.3 0 top
LS1  11.43,45.4 0 top
R1  66.99,2.22 90 top
R2  63.82,2.86 180 top
R3  53.02,19.68 180 top
R4  53.66,17.14 180 top
R5  41.27,11.43 180 bottom
R6  37.15,11.43 0 bottom
R7  47.94,17.14 180 bottom
R8  40.32,12.38 90 bottom
R9  38.1,12.38 90 bottom
R10  47.94,19.68 180 bottom
R11  40.01,24.77 270 top
R12  76.83,22.86 90 bottom
R13  74.3,22.86 90 bottom
R14  74.61,38.73 270 top
R15  68.26,25.08 90 bottom
R16  16.19,28.26 180 bottom
R17  54.93,50.16 180 top
R18  11.43,3.17 270 top
R19  13.97,6.99 270 top
R20  13.97,3.17 270 top
R21  44.77,4.45 270 top
R22  36.51,40.01 90 bottom
R23  36.83,51.75 270 bottom
R24  39.37,76.2 90 bottom
R25  76.83,42.55 90 top
R26  73.03,42.55 90 top
R27  72.71,27.62 0 bottom
R28  68.26,33.02 180 bottom
R29  72.71,30.16 0 bottom
R30  64.45,13.97 180 top
R31  69.85,40.32 90 top
R32  13.97,50.16 180 bottom
R33  6.99,60.64 0 bottom
R34  10.79,50.16 90 bottom
R35  8.26,52.07 270 bottom
R36  11.43,55.88 0 bottom
R37  8.26,55.24 90 bottom
R38  8.26,40.32 270 bottom
R39  8.89,36.51 0 bottom
R40  55.56,6.99 180 top
R41  30.16,42.23 90 bottom
R42  47.94,8.89 270 top
R43  51.75,5.71 0 top
R44  49.85,3.49 0 top
R45  13.02,68.58 90 top
R46  16.19,69.85 0 top
R48  63.82,64.14 0 bottom
R49  63.82,61.59 0 bottom
R50  66.99,61.91 270 bottom
R51  70.48,53.66 90 top
R52  74.61,53.66 90 top
R53  76.83,53.66 90 top
R54  53.66,42.86 270 top
R55  65.72,11.11 90 top
SJR1  71.44,26.67 270 top
T1  65.72,6.35 0 top
T2  61.91,6.35 0 top
T3  10.79,40.32 0 bottom
TP1  71.75,36.83 0 top
TP2  73.66,15.88 0 top
TP3  69.85,36.83 0 top
TP4  65.09,36.83 0 top
TP5  59.05,23.18 0 top
TP6  69.22,15.56 0 top
TP7  59.05,27.3 0 top
TP8  59.05,25.4 0 top
TP9  71.75,15.88 0 top
TP10  60.64,78.74 0 top
TP11  19.37,38.42 0 top
TP12  57.15,71.75 0 top
TP13  31.43,37.78 0 top
TP14  69.85,78.74 0 top
TP15  71.12,78.11 0 top
TP16  72.39,78.74 0 top
TP17  61.91,56.2 0 top
TP18  55.88,70.48 0 top
TP19  57.15,69.22 0 top
TP20  55.88,67.94 0 top
TP21  57.15,66.67 0 top
TP22  55.88,65.41 0 top
TP23  57.15,64.14 0 top
TP24  61.91,80.64 0 top
TP25  63.18,54.29 0 top
TP26  64.45,56.2 0 top
TP27  60.64,54.29 0 top
U1  14.92,22.54 0 bottom
U2  69.5,67.31 0 top
U3  40.64,18.1 0 bottom
U4  48.9,46.67 180 top
U6  21.91,63.5 0 top
U$1  25.08,42.23 270 bottom
Y1  31.75,14.61 90 bottom
Y2  16.83,16.83 180 bottom
Y3  67.31,80.96 0 top

### Tracks (layer width: path | path; a pad name or v marks a point on that pad's centre or on a via)
3.3V  (via drill 0.38 pad 0.81, 0.4 pad 0.81, 0.6)
  Top 0.254: IC1.6 IC1.7 49.7,9.74 R42.1 47.84,9.84 v46.35,9.84 | v46.35,12.38 43.5,15.24 39.69,15.24 v39.69,17.46 | 22.41,66.36 22.41,66.49 21.91,66.99 20.64,66.99 20.32,66.67 U6.1 19.64,64.5 18.41,65.72 C27.1 C28.1 17.04,67.65 R46.2 | 22.41,66.36 U6.14 | v24.13,35.88 24.13,36.2 21.91,38.42 | TP11.TP 19.37,39.05 18.73,39.69 18.73,57.78 v19.68,58.74 | v25.4,66.67 22.73,66.67 22.41,66.36
  Top 0.305: R11.2 38.63,22.54 v38.42,22.54 | 53.66,39.69 50.8,42.55 U4.8 50.8,44.77 50.48,45.09 46.67,45.09 45.72,44.13 44.45,44.13 44.13,44.45 C17.1 | 53.66,39.69 55.24,38.1 55.24,34.61 55.56,34.29 | 44.13,37.47 44.45,37.15 | R54.2 53.66,39.69 | 75.88,77.47 75.93,77.42 U2.2 75.88,76.36 75.88,77.47 | 75.25,78.82 75.25,78.11 75.88,77.47 | 75.25,78.82 C24.1 C25.1 | v73.03,45.09 R26.2 R25.2 | v62.87,44.45 62.87,37.15 62.07,36.35 | 75.25,78.82 75.25,79.06 74.93,79.38 74.93,81.92
  Top 0.406: R18.2 R20.2 17.26,2.33 LIGHT_DR.1 | v64.14,31.75 63.28,32.61 SJR1.8
  Top 0.61: v38.42,22.54 36.83,24.13 v21.59,24.13
  Top 0.813: TP11.TP 21.91,38.42 C23.+ 22.38,37.62 v24.13,35.88 | 74.93,81.92 v72.07,81.92 | v17.14,74.61 17.04,74.51 R46.2
  Top 1.016: v24.13,35.88 23.81,35.56 23.81,32.07 29.21,32.07 34.29,37.15 44.45,37.15 49.85,37.15 52.7,34.29 55.56,34.29 57.78,36.51 61.91,36.51 62.07,36.35 63.18,35.24 63.18,34.38 SJR1.8
  Bottom 0.203: 25.4,57.15 26.35,57.15 28.57,59.37 28.57,64.77 26.67,66.67 v25.4,66.67
  Bottom 0.254: v46.35,9.84 v46.35,12.38 | v39.69,17.46 37.78,19.37 34.92,19.37 C2.1 C3.1 | L1.2 23.62,40.83 23.81,40.64 23.81,39.37 24.13,39.05 | v19.68,58.74 20.64,58.74 22.23,57.15 25.4,57.15
  Bottom 0.305: 37.15,23.81 C3.1 | R29.2 R27.2 71.75,27.73 71.75,30.16 70.48,31.43 69.22,31.43 | 69.22,31.43 68.26,31.43 67.31,30.48 C12.1 | R28.2 69.22,32.92 69.22,31.43 | v73.03,45.09 69.85,45.09 69.22,44.45 v62.87,44.45
  Bottom 0.406: C12.1 C11.1 65.41,30.48 v64.14,31.75
  Bottom 0.61: R16.2 17.04,25.56 U1.8 17.09,25.08 18.41,25.08 19.37,24.13 C10.1 20.88,23.42 v21.59,24.13 | C2.1 35,23.81 37.15,23.81 v38.42,22.54 | v24.13,35.88 21.59,33.34 v21.59,24.13 | LIGHT_DR.1 18.1,3.44 18.1,10.16 21.59,13.65 v21.59,24.13
  Bottom 0.813: U$1.4 23.78,40.64 | 23.78,40.64 23.78,40.11 C21.1 24.13,39.61 24.13,39.05 v24.13,35.88 | L1.2 23.59,40.83 23.78,40.64 | v17.14,74.61 17.14,84.77 24.45,92.08 65.09,92.08 71.44,85.72 71.44,82.55 v72.07,81.92
5V  (via drill 0.38 pad 0.81, 0.4 pad 0.81)
  Top 0.203: v29.53,4.45 29.53,5.4
  Top 0.305: v34.61,1.59 34.61,6.35 34.29,6.67
  Top 0.406: v44.13,23.81 34.92,14.61 34.92,7.3 | R43.2 52.7,5.61 v52.7,3.49
  Top 0.5: J3.VBUS 38.17,6.6 37.47,7.3
  Top 0.813: C15.+ 37.15,79.53 37.15,71.75 38.1,70.8 38.1,67.94 38.1,67.63 38.13,67.66 LED_12.2
  Top 1.016: LED_24.2 38.13,81.47 C15.+ | LED_12.2 38.13,63.69 C14.+ 38.1,63.66 38.1,67.94
  Top 1.2: 37.47,7.3 34.92,7.3 34.29,6.67 33.02,5.4
  Top 1.27: 28.57,5.4 29.53,5.4 33.02,5.4
  Bottom 0.203: 28.26,5.4 28.57,5.4 v29.53,4.45
  Bottom 0.254: R34.2 12.27,51.02 | 12.27,51.02 R32.1 | 12.27,51.02 IC2.5 | v34.61,1.59 34.61,0.64 51.44,0.64 52.7,1.91 v52.7,3.49
  Bottom 0.305: C4.1 C5.1 41.99,23.81 v44.13,23.81 | R22.2 33.76,40.85 33.66,40.96
  Bottom 0.406: D4.1 44.28,23.96 v44.13,23.81
  Bottom 0.61: R32.1 12.7,49.74 12.7,47.94 12.06,47.31 12.06,45.09 14.61,42.55 16.51,42.55 17.46,43.5 17.46,46.04 18.1,46.67 26.35,46.67 28.89,44.13 28.89,43.1
  Bottom 0.813: U$1.1 28.18,43.18 C22.1
  Bottom 1.016: C6.1 38.49,86.44 LED_24.2 | C9.1 38.49,68.02 38.1,67.63 | 38.1,67.63 38.1,68.08 LED_12.2 | 38.1,67.63 38.1,63.82 30.16,56.52 30.16,43.18
  Bottom 1.27: C22.1 28.89,43.1 30.14,43.1 R41.2 30.27,43.18 | 30.27,43.18 30.16,43.18 | 30.27,43.18 33.66,43.18 33.66,40.96 33.66,36.2 26.04,28.57 26.04,7.62 28.26,5.4 29.53,5.4
ACTIVE
  Top 0.305: R40.2 54.08,7.62 53.02,7.62 52.39,8.26 IC1.11
ADC  (via drill 0.4 pad 0.81)
  Top 0.305: 75.25,34.32 SJR1.2 75.28,32.1 75.25,32.07 | v68.58,29.84 70.8,32.07 75.25,32.07 | 75.25,34.32 75.25,36.51 74.61,37.15 R14.2 | 75.25,34.32 75.25,32.07 | 75.25,32.07 75.25,31.43 v75.56,31.11 | U2.4 73.34,76.26 73.34,72.71 75.88,70.17 v75.88,60.64 | v73.03,50.8 74.93,48.9 v74.93,46.04
  Bottom 0.305: C31.2 68.24,25.96 R15.2 68.58,26.25 v68.58,29.84 | v75.56,31.11 75.25,31.43 75.25,39.69 76.2,40.64 76.2,44.77 v74.93,46.04 | v73.03,50.8 73.03,57.78 v75.88,60.64
D_N  (via drill 0.4 pad 0.82)
  Top 0.5: v38.7,8.57 38.7,7.9 38.82,7.61 38.82,5.05 J3.D-
  Bottom 0.203: R6.1 R9.1
  Bottom 0.5: R9.1 38.6,11.53 38.7,11.43 v38.7,8.57
D_N_CP  (via drill 0.38 pad 0.81)
  Top 0.305: IC1.5 45.22,10.93 44.13,9.84 v36.51,9.84
  Bottom 0.305: v36.51,9.84 36.51,11.21 R6.2
D_P  (via drill 0.4 pad 0.81)
  Top 0.5: J3.D+ 39.48,5.04 39.48,6.96 39.48,6.87 39.48,7.77 40.04,8.32 v40.04,8.89
  Bottom 0.203: R5.1 R8.1
  Bottom 0.5: R8.1 40.14,11.53 39.4,11.11 39.37,11.08 39.37,9.53 40.01,8.89 v40.04,8.89
D_P_CP  (via drill 0.38 pad 0.81)
  Top 0.305: IC1.4 v44.13,11.43
  Bottom 0.305: v44.13,11.43 R5.2
DTR  (via drill 0.4 pad 0.81)
  Top 0.305: v41.27,17.46 47.35,17.46 v49.24,15.58 IC1.28
  Top 0.406: R1.2 66.67,3.39 T1.2 66.82,5.4 v68.26,5.4
  Bottom 0.305: v41.27,17.46 U3.13 | v68.26,5.4 66.36,7.3 54.61,7.3 52.39,9.53 51.12,9.53 50.89,9.61 IC1.28 v49.24,15.58
EN
  Top 0.305: SJR1.3 73.03,34.54 R26.1
FLASH_CS  (via drill 0.4 pad 0.81)
  Top 0.305: U4.1 51.04,50.16 R17.2 53.98,50.27 53.98,51.44 54.61,52.07 v56.52,52.07 59.69,48.9 v59.69,43.5 | R31.2 v69.85,43.5
  Bottom 0.305: v69.85,43.5 v59.69,43.5 | R50.1 66.78,62.55 66.04,62.55 65.09,61.59 R49.1 64.45,61.38 64.45,60.64 63.82,60.01 57.78,60.01 56.52,58.74 v56.52,52.07
GND  (via drill 0.38 pad 0.81, 0.4 pad 0.81, 1 pad 1.68)
  Top 0.203: U6.10 26.8,63 v27.3,63.5
  Top 0.254: 45.09,7.94 47.62,5.4 47.62,1.59 | C26.2 15.24,63.74 15.24,62.87 v15.61,62.5 15.32,62.79 C26.2 | C26.2 C27.2 C28.2 13.12,67.63 R45.1 | v25.72,65.09 24.63,64 U6.12 | U6.5 20.32,61.59 v19.68,60.96 20.32,61.59 U6.5
  Top 0.305: IC1.EXP 51.89,11.93 IC1.3 48.71,11.93 v47.31,13.34 47.31,13.97 49.85,13.97 IC1.M | R40.1 56.2,7.2 v56.2,8.57 58.74,8.57 | R44.1 47.31,3.49 44.87,3.49 R21.2 | SJR1.9 63.6,17.77 R30.2 | v29.53,14.61 23.81,14.61 23.81,10.16 22.86,9.21 21.59,9.21 v21.27,8.89 | 63.18,18.18 63.73,18.18 63.82,18.1 63.82,22.54 v64.77,23.5 | C17.2 44.13,48.58 45.4,49.85 46.91,49.85 U4.4 | U2.15 63.78,73.03 U2.GND | C29.2 C30.2 75.23,84.47 75.25,84.45 | U2.1 77.2,78.61 C24.2 C25.2 76.83,81.99 | 76.83,81.99 76.83,82.87 75.25,84.45 | 77.15,67.94 77.15,79.06 76.83,79.38 76.83,81.99 | 75.25,84.45 66.04,84.45 v66.04,86.04 | v61.59,86.04 59.37,86.04 56.2,82.87 56.2,73.66
  Top 0.406: J3.GND 40.79,4.99 40.79,7.3 | SJR1.9 63.18,18.18 | U2.38 77.2,67.9 77.15,67.94 77.2,67.99 U2.1 | U2.GND 70.14,67.94 | 33.66,53.81 33.66,53.98 32.38,55.24 26.67,55.24 v23.5,58.42 | U4.4 46.99,51.44 42.86,55.56 39.05,55.56 37.23,57.39 | 33.97,53.02 33.66,53.34
  Top 0.61: 40.79,7.3 41.43,7.94 v41.59,7.94 v42.86,7.94 v44.13,7.94 45.09,7.94 | R19.1 14.34,8.2 15.03,8.89 v21.27,8.89 | 15.03,33.87 BT1.2
  Top 0.813: TP13.TP 28.42,37.78 C23.- 27.78,37.31 v26.35,35.88 | C15.- 42.23,79.85 42.23,73.66 | LED_12.3 40.67,70.52 42.23,72.07 42.23,73.66 | 15.03,33.87 10.69,33.87 6.03,29.21 6.03,14.29 v8.57,11.75 | v13.97,10.48 13.97,8.57 14.34,8.2 | v29.53,22.54 v29.53,14.61 | 42.23,73.66 56.2,73.66 58.56,73.66 U2.15
  Top 1.016: LED_24.3 40.67,81.41 C15.- | LED_12.3 40.67,63.63 C14.- 37.23,57.39 33.66,53.81 33.66,53.34 33.66,39.37 32.38,38.1 28.26,38.1 26.35,36.2 v26.35,35.88
  Top 1.27: 45.09,7.94 47.31,5.71 47.31,3.49 47.31,1.91 47.62,1.59 47.94,1.27 58.1,1.27 58.74,1.91 58.74,8.57 58.74,14.61 62.22,18.09 SJR1.9
  Bottom 0.203: v27.3,63.5 25.4,63.5 25.08,63.82
  Bottom 0.254: IC2.2 8.26,53.34 R35.1 | C2.2 C3.2 C4.2 | C31.1 65.33,23.5 v64.77,23.5 | v15.61,62.5 18.14,62.5 v19.68,60.96 20,60.96 22.54,58.42 v23.5,58.42 | 25.08,58.42 25.08,63.82 25.08,64.45 v25.72,65.09
  Bottom 0.305: R15.1 68.24,24.21 C31.1 66.12,24.13 C16.2 | C5.2 C4.2 | v56.2,8.57 53.34,11.43 IC1.EXP | C1.1 38.98,45.62 D1.3 | 27.94,14.61 v29.53,14.61 | v66.04,86.04 v61.59,86.04
  Bottom 0.406: C13.2 v47.31,13.34 | U$1.2 27.3,42.23 27.62,41.91 27.7,41.91 C22.2 | 28.26,39.69 C21.2 | C11.2 C12.2 67.23,28.57 65.41,28.57 64.77,27.94 v64.77,23.5 | v23.5,58.42 25.08,58.42
  Bottom 0.5: C8.2 27.94,14.61 C7.2 | C13.2 45.01,15.22 U3.1
  Bottom 0.61: R35.1 7.2,52.92 | 7.2,52.92 5.71,51.44 5.71,47.94 | 5.71,47.94 5.71,40.96 6.99,39.69 8.04,39.69 R38.2 | C18.1 5.75,54.37 7.2,52.92 | U1.4 13.02,21.59 | 13.02,21.59 13.97,22.54 16.83,22.54 17.78,21.59 19.29,21.59 C10.2 | 13.02,21.59 10.79,23.81 10.79,30.16 14.29,33.66 BT1.2 13.65,34.5 13.65,41.59 10.48,44.77 10.48,46.35 8.89,47.94 5.71,47.94 | C1.1 41.59,43.18 42.23,42.55 42.23,38.1 40.64,36.51 36.83,36.51 34.92,34.29 J1.6 | v21.27,8.89 21.59,9.21 23.81,9.21 | 23.81,29.53 27.3,33.02 v27.3,34.61
  Bottom 0.813: T3.2 8.51,39.22 R38.2 | C2.2 34.92,25.72 | v26.35,35.88 v28.26,35.88 | v8.57,11.75 12.7,11.75 v13.97,10.48 | J1.6 34.92,25.72 | 34.92,25.72 32.7,25.72 v29.53,22.54
  Bottom 1.016: C6.2 40.24,86.51 LED_24.3 | C9.2 40.24,68.54 LED_12.3
  Bottom 1.27: C22.2 28.26,39.69 v28.26,35.88 28.26,33.97 23.81,29.53 23.81,9.21 23.81,6.35 24.77,5.4 24.77,1.91 32.38,1.91 33.66,3.17 33.66,5.71 34.92,6.99 40.79,6.99 40.79,7.13 v41.59,7.94
  other vias: 52.39,11.43
GPIO0
  Top 0.406: R55.1 T1.3
GPIO2  (via drill 0.4 pad 0.81)
  Top 0.305: 67.31,18.06 SJR1.11 66.99,18.38 66.99,19.05 65.41,20.64 65.41,21.59 66.36,22.54 66.36,31.43 v65.72,32.07 | U2.24 59.2,53.51 61.28,51.44 v61.28,39.37
  Bottom 0.305: v65.72,32.07 66.67,33.02 R28.1 67.31,33.12 67.31,38.1 66.04,39.37 v61.28,39.37
GPIO5  (via drill 0.4 pad 0.81)
  Top 0.305: v73.34,20 73.34,18.16 SJR1.14 73.28,16.26 TP2.TP
  Bottom 0.305: v73.34,20 74.3,20.95 R13.1
GPIO15
  Top 0.305: R30.1 65.28,14.95 SJR1.10
GPIO16
  Top 0.305: TP1.TP 71.75,34.77 SJR1.4
INT1  (via drill 0.4 pad 0.81)
  Top 0.254: U6.11 25.08,63.5 25.72,64.14 27.94,64.14
  Top 0.305: SJR1.7 65.28,36.64 TP4.TP 65.09,50.8 v66.99,52.7 | 27.94,64.14 27.94,84.45 35.88,92.39 59.69,92.39 64.77,87.31 64.77,79.69 65.72,78.74 65.72,76.36 U2.10 65.72,76.26 65.72,73.34 67.31,71.75 72.39,71.75 74.61,69.53 v74.61,62.23
  Bottom 0.305: v74.61,62.23 72.07,62.23 70.8,60.96 70.8,55.24 68.26,52.7 v66.99,52.7
INT2
  Top 0.305: U6.9 27.57,62.5 29.21,64.14 29.21,84.14 36.51,91.44 58.74,91.44 63.5,86.68 63.5,78.74 64.5,77.74 U2.11
LED_12DI
  Bottom 0.406: R24.1 39.27,75.25 37.47,75.25 35.59,73.38 LED_12.1
LED_24_DI
  Bottom 0.406: R23.1 36.83,53.98 40.64,57.78 44.13,57.78 45.72,59.37 45.72,88.9 44.13,90.49 37.47,90.49 35.56,88.58 35.56,86.11 LED_24.1
LED_24_DO
  Bottom 0.406: R24.2 43.21,80.89 LED_24.4
LED_WS  (via drill 0.4 pad 0.81)
  Top 0.406: SJR1.6 67.28,45.37 v67.31,46.99 67.31,49.63 R51.1 R52.1
  Bottom 0.406: v67.31,46.99 43.23,46.99 D1.4
  Bottom 0.61: D1.4 41.96,45.4
MISO  (via drill 0.4 pad 0.81)
  Top 0.305: SJR1.18 60.24,29.29 v59.05,30.48 | v56.52,43.81 56.41,43.71 R54.1 51.33,46.04 49.53,46.04 U4.2
  Bottom 0.305: v59.05,30.48 56.52,33.02 v56.52,43.81
MOSI  (via drill 0.4 pad 0.81)
  Top 0.305: TP5.TP v53.34,28.89 | v46.99,40.01 U4.5
  Top 0.406: TP5.TP 61.16,23.18 SJR1.21
  Bottom 0.305: v46.99,40.01 46.99,39.69 50.16,36.51 50.16,32.07 v53.34,28.89
N$1
  Top 0.406: R1.1 66.57,0.95 61.59,0.95 60.96,1.58 T2.1
N$2
  Top 0.406: T1.1 64.67,5.14 R2.1
N$3
  Bottom 0.305: D3.3 38.27,41.42 37.47,42.23 37.47,42.94 C1.2 36.79,43.61 D1.1
N$4
  Bottom 0.5: R7.1 44.45,17.14 43.81,16.51 U3.2
N$5
  Bottom 0.5: U3.3 42.55,16.83 44.45,18.73 46.35,18.73 46.35,18.95 R10.1
N$6
  Bottom 0.5: U3.5 40.01,13.55 R8.2
N$7
  Bottom 0.5: R9.2 38.31,13.23 38.73,13.65 U3.6
N$8
  Bottom 0.5: U3.7 37.47,14.61 36.51,13.65 34.29,13.65 31.75,11.11 Y1.1 31.7,9.83 C7.1
N$9
  Bottom 0.5: U3.4 41.27,14.61 42.55,13.34 C13.1
N$10
  Bottom 0.5: U3.8 35.88,15.3 Y1.2 27.99,19.43 C8.1
N$11  (via drill 0.4 pad 0.81)
  Top 0.305: R11.1 40.01,26.35 40.96,27.3 v41.59,27.3
  Bottom 0.305: v41.59,27.3 40.96,27.3 40.01,28.26 J1.4
N$12
  Top 0.305: C30.1 68.56,83.15 Y3.P$2 68.31,80.71 U2.8
N$13
  Top 0.305: C29.1 66.06,83.15 Y3.P$1 67.04,79.98 U2.9
N$14  (via drill 0.4 pad 0.81)
  Top 0.305: R19.2 13.87,6.03 12.38,6.03 11.11,7.3 11.11,17.46 8.89,19.68 8.89,28.89 10.48,30.48 55.56,30.48 v59.37,34.29 | v74.93,41.91 74.93,40.64 74.61,40.32 R14.1
  Top 0.406: R18.1 R20.1 R19.2 20.85,6.13 20.95,6.03 20.95,3.48 LIGHT_DR.2
  Bottom 0.305: v74.93,41.91 61.91,41.91 59.37,39.37 v59.37,34.29
N$15
  Bottom 0.5: D4.3 46.99,21.59 46.35,20.95 45.14,20.95 U3.16
N$16
  Bottom 0.305: D3.1 40.32,38.41 39.69,37.78 37.15,37.78 36.51,38.42 R22.1
N$17  (4 unrouted)
  Top 0.203: J3.SHIELD6 42.17,2.42 J3.SHIELD7 | J3.SHIELD5 J3.SHIELD8 | J3.SHIELD 36.96,5.25 J3.SHIELD9 36.65,5.17 J3.SHIELD | J3.SHIELD2 41.98,5.25 J3.SHIELD10 42.29,5.17 J3.SHIELD2
  Top 0.305: J3.SHIELD2 44.72,5.25 R21.1 | J3.SHIELD6 36.78,2.4 J3.SHIELD5 | J3.SHIELD4 42.05,2.3 J3.SHIELD7 38.65,2.44 J3.SHIELD3
  Bottom 0.305: J3.SHIELD5 36.74,5.08 36.65,5.17 | J3.SHIELD7 42.2,5.08 42.29,5.17 | J3.SHIELD10 42.29,5.17 | 42.29,5.17 J3.SHIELD2 | J3.SHIELD9 36.65,5.17 | 36.65,5.17 J3.SHIELD
N$18
  Bottom 0.406: D1.2 36.79,50.87 R23.2
N$19
  Top 0.254: U6.2 17.25,64 C26.1
N$20  (via drill 0.4 pad 0.81)
  Top 0.305: U2.23 60.01,62.87 60.64,63.5 60.64,64.14 v61.28,64.77
  Bottom 0.305: R49.2 R48.2 61.91,64.14 v61.28,64.77
N$21
  Top 0.305: SJR1.5 69.22,34.35 69.22,36.2 TP3.TP R31.1
N$22  (via drill 0.4 pad 0.81)
  Top 0.305: SJR1.17 62.05,31.29 v63.5,29.84 | v57.78,41.27 57.78,48.16 R17.1
  Bottom 0.305: v63.5,29.84 61.91,31.43 60.01,31.43 57.78,33.66 v57.78,41.27
N$23
  Top 0.61: R51.2 70.85,54.87 U2.33
N$24
  Top 0.61: R52.2 74.66,54.55 U2.36
N$25
  Bottom 0.813: T3.3 8.51,41.42 R38.1 8.18,41.25 LS1.-
N$26
  Bottom 0.61: R39.1 10.16,36.51 11.43,37.78 11.43,38.91 T3.1
N$27  (via drill 0.4 pad 0.81)
  Top 0.305: v31.43,39.69 30.48,39.69 29.21,40.96 29.21,44.13 27.94,45.4 v25.08,45.4
  Bottom 0.305: R41.1 30.16,40.96 v31.43,39.69 | v25.08,45.4 25.08,41.59 25.4,41.27 U$1.3
N$28
  Bottom 0.254: IC2.1 10.14,52.69 8.89,51.44 8.47,51.44 R35.2 8.26,50.8 9.53,49.53 10.58,49.53 R34.1
N$30
  Bottom 0.61: U1.1 17.09,19.74 18.1,18.73 18.1,16.85 Y2.P$2
N$31
  Bottom 0.61: Y2.P$1 15.58,19.72 U1.2
N$32
  Bottom 0.254: R36.2 IC2.3
  Bottom 0.61: R37.1 8.47,54.61 9.53,54.61 10.58,55.66 R36.2
N$33
  Bottom 0.254: C20.1 14.82,52.47 R32.2
  Bottom 0.813: R32.2 14.82,45.54 LS1.+
N$34
  Bottom 0.61: R37.2 8.26,57.71 C19.1
N$35
  Bottom 0.254: C20.2 12.28,54.22 IC2.4 R36.1
N$36
  Bottom 0.61: R39.2 7.62,36.51 4.45,39.69 4.45,55.24 5.08,55.88 5.47,55.88 C18.2 5.71,57.71 C19.2 6.13,58.13 R33.2
N$37
  Bottom 0.813: U$1.5 21.09,43.18 L1.1
N$38  (via drill 0.4 pad 0.81)
  Top 0.305: R42.2 48.36,7.62 v49.53,7.62 | v51.75,7.62 51.39,8.3 IC1.9
  Bottom 0.305: v49.53,7.62 v51.75,7.62
N$39
  Top 0.305: IC1.8 50.89,5.73 R43.1 50.7,5.51 R44.2
N$40  (via drill 0.4 pad 0.81)
  Top 0.254: R45.2 13.44,69.85 R46.1 15.34,70.7 v14.29,71.75 | U6.7 21.91,60.33 22.54,59.69 v23.5,59.69
  Bottom 0.254: v23.5,59.69 14.29,68.9 v14.29,71.75
N$41  (via drill 0.4 pad 0.81)
  Top 0.305: v66.67,55.88 65.72,56.83 65.72,58.26 U2.29
  Bottom 0.305: R50.2 66.78,61.06 65.72,60.01 65.72,56.83 v66.67,55.88
N$42
  Top 0.406: R53.2 76.83,55.88 75.93,56.78 U2.37
N$43
  Top 0.305: TP14.TP 69.85,76.58 U2.7
N$44
  Top 0.305: TP15.TP 71.12,76.58 U2.6
N$45
  Top 0.305: TP16.TP 72.39,76.58 U2.5
N$46
  Top 0.305: TP17.TP 61.91,58.26 U2.26
N$47
  Top 0.406: TP18.TP U2.17
N$48
  Top 0.406: TP19.TP U2.18
N$49
  Top 0.406: TP20.TP U2.19
N$50
  Top 0.406: TP21.TP U2.20
N$51
  Top 0.406: TP22.TP U2.21
N$52
  Top 0.406: TP23.TP U2.22
N$53  (via drill 0.38 pad 0.81)
  Bottom 1.2: v45.4,7.94 41.91,7.94 40.96,6.99 34.92,6.99 33.34,5.4
N$55  (via drill 0.6 pad 0.61)
  other vias: 31.75,4.45
N$56  (via drill 0.6 pad 0.61)
  other vias: 30.8,5.71
N$57  (via drill 0.6 pad 0.61)
  other vias: 29.53,4.45
N$58  (via drill 0.4 pad 0.81)
  other vias: 22.23,35.88
N$59  (via drill 0.6 pad 0.61)
  other vias: 27.3,4.45
N$60  (via drill 0.6 pad 0.61)
  other vias: 28.57,5.71
N$61  (via drill 0.4 pad 0.81)
  other vias: 23.18,34.61
N$62  (via drill 0.4 pad 0.81)
  other vias: 27.3,34.61
N$63
  Top 0.305: TP10.TP 60.64,76.36 U2.14
N$64
  Top 0.406: TP12.TP U2.16
N$65
  Top 0.305: TP24.TP 61.91,76.36 U2.13
N$66
  Top 0.305: U2.27 63.23,54.34 TP25.TP
N$67
  Top 0.305: TP26.TP 64.45,58.26 U2.28
N$68
  Top 0.305: U2.25 60.69,54.34 TP27.TP
N$69  (via drill 0.6 pad 0.81)
  other vias: 15.88,76.83
N$70  (via drill 0.6 pad 0.81)
  other vias: 18.41,76.83
N$71  (via drill 0.6 pad 0.81)
  other vias: 70.48,81.92
NRST  (via drill 0.4 pad 0.81)
  Top 0.305: T2.3 v61.91,10.48 | v70.17,29.21 76.2,29.21 77.28,30.29 SJR1.1 77.47,34.48 77.47,37.78 76.83,38.42 R25.1 77.89,41.7 78.11,41.91 78.11,47.62 v77.79,47.94 | v74.61,74.3 74.61,76.26 U2.3
  Bottom 0.305: C16.1 69.22,21.91 | 69.22,21.91 70.17,22.86 v70.17,29.21 | v61.91,10.48 61.91,11.43 62.23,11.75 68.58,11.75 69.22,12.38 69.22,21.91 | v77.79,47.94 78.11,48.26 78.11,70.8 v74.61,74.3
PWM  (via drill 0.4 pad 0.81)
  Top 0.254: v32.07,46.99 30.8,48.26 v27.3,48.26
  Top 0.305: v76.83,51.12 R53.1
  Bottom 0.254: 9.84,60.64 14.92,55.56 15.88,55.56 16.51,54.93 16.51,49.53 17.78,48.26 v27.3,48.26
  Bottom 0.305: R13.2 R12.2 76.83,29.21 77.15,29.53 77.15,46.99 76.2,47.94 | 76.2,47.94 45.72,47.94 42.86,50.8 39.37,50.8 38.73,50.16 38.73,47.62 38.1,46.99 v32.07,46.99 | 9.84,60.64 R33.1 | 76.2,47.94 76.83,48.58 v76.83,51.12 77.15,51.44 77.15,61.59 74.61,64.14 R48.1
RTS  (via drill 0.4 pad 0.81)
  Top 0.305: v42.55,19.37 43.5,18.41 49.21,18.41 50.8,16.83 v50.8,15.88 | v54.29,15.24 53.34,15.24 52.89,14.79 IC1.24 | v63.82,8.26 63.82,6.67 62.86,5.71 T2.2
  Top 0.406: T2.2 62.97,5.14 R2.2
  Bottom 0.305: U3.14 v42.55,19.37 | v50.8,15.88 51.44,15.24 v54.29,15.24 55.56,15.24 56.2,14.61 56.2,12.38 60.33,8.26 v63.82,8.26
RXD0  (via drill 0.38 pad 0.81, 0.4 pad 0.81)
  Top 0.305: v53.98,21.59 53.87,21.49 R3.1 | SJR1.15 75.25,18.12 v75.25,20 73.34,21.91 73.34,23.18 72.71,23.81 68.9,23.81 68.9,20.95 v68.26,20.32 | U2.34 72.12,59.64 71.75,60.01 62.55,60.01 v61.28,61.28 | v40.64,53.02 39.69,52.07 39.69,42.23 40.64,41.27 43.5,41.27 43.81,40.96 v43.81,39.05
  Bottom 0.305: R7.2 49.85,17.14 50.8,18.1 50.8,21.59 | 50.8,21.59 v53.98,21.59 53.98,21.27 55.56,19.68 67.63,19.68 v68.26,20.32 | v75.25,20 76.83,20 R12.1 | 50.8,21.59 50.8,25.08 50.48,25.4 44.13,25.4 43.5,26.04 43.5,26.67 42.55,27.62 J1.3 42.55,34.92 43.81,36.2 v43.81,39.05 | v61.28,61.28 54.29,61.28 45.09,52.07 41.59,52.07 v40.64,53.02
RXD0_CP2101IN
  Top 0.305: R3.2 51.89,19.4 IC1.26
SCL  (via drill 0.4 pad 0.81)
  Top 0.254: U6.4 20.3,62.98 18.78,62.98 17.14,61.35 v17.14,34.29
  Top 0.305: 69.28,16.83 69.28,15.88 TP6.TP 69.22,12.7 68.26,11.75 65.94,11.75 R55.2 | 69.28,16.83 SJR1.12 69.22,18.15 69.22,20 v70.48,21.27 | v13.65,27.94 13.97,28.26 49.21,28.26 52.07,25.4 53.34,25.4 58.1,20.64 v58.1,17.46 | v67.31,15.88 68.33,15.88 69.28,16.83 | v66.04,40.64 66.04,50.16 69.22,53.34 69.22,56.52 68.31,57.42 U2.31
  Bottom 0.254: v17.14,34.29 19.37,34.29 20,33.66 20,30.8 19.37,30.16 14.92,30.16 13.65,28.89 v13.65,27.94
  Bottom 0.305: v70.48,21.27 71.12,21.91 71.12,25.72 71.44,26.04 72.71,26.04 73.56,26.89 R27.1 72.71,28.47 72.71,33.97 v66.04,40.64 | U1.6 14.29,26.67 13.65,27.3 v13.65,27.94 | v58.1,17.46 58.1,15.56 66.67,15.56 v67.31,15.88
SCLK  (via drill 0.4 pad 0.81)
  Top 0.305: U4.6 48.26,41.91 v53.66,36.51 | v63.5,25.4 63.5,23.5 63.18,23.18 63.18,22.54 62.55,21.91 62.55,21.59 62.23,21.27 61.3,21.27 SJR1.22
  Bottom 0.305: v53.66,36.51 53.66,33.97 58.42,29.21 59.69,29.21 v63.5,25.4
SDA  (via drill 0.4 pad 0.81)
  Top 0.254: U6.6 21.41,60.58 20.52,59.69 18.73,59.69 18.1,59.05 v18.1,32.7
  Top 0.305: v71.75,20.32 71.75,19.68 71.44,19.37 71.44,18.25 SJR1.13 71.28,16.35 TP9.TP v71.75,13.02 | v12.38,26.99 12.38,28.26 13.65,29.53 49.53,29.53 52.7,26.35 53.66,26.35 59.37,20.64 v59.37,18.73 | v71.44,40.64 71.44,50.48 v71.12,50.8 | v68.26,55.24 68.26,56.2 66.99,57.47 66.99,58.26 U2.30
  Bottom 0.254: v18.1,32.7 17.14,31.75 14.29,31.75 12.38,29.84 v12.38,26.99
  Bottom 0.305: v71.75,20.32 72.07,20.64 72.07,25.08 73.66,25.08 74.93,26.35 74.93,28.89 73.66,30.16 R29.1 73.56,38.52 v71.44,40.64 | U1.5 13.02,26.35 v12.38,26.99 | v59.37,18.73 56.83,18.73 56.83,15.24 60.64,11.11 60.64,9.53 68.9,9.53 v71.75,13.02 | v71.12,50.8 66.99,50.8 65.41,52.39 65.41,53.02 66.36,53.98 66.99,53.98 v68.26,55.24
SPI_HOLD  (via drill 0.4 pad 0.81)
  Top 0.305: SJR1.19 61.26,27.3 TP7.TP 58.74,27.3 v57.15,28.89 | v50.16,41.27 49.53,41.91 U4.7
  Bottom 0.305: v57.15,28.89 57.15,29.21 52.7,33.66 52.7,38.73 v50.16,41.27
SPI_WP  (via drill 0.4 pad 0.81)
  Top 0.305: SJR1.20 59.16,25.29 TP8.TP 58.74,25.4 v55.24,28.89 | U4.3 48.26,48.26 v45.72,45.72
  Bottom 0.305: v55.24,28.89 55.24,29.84 51.75,33.34 51.75,37.15 47.94,40.96 46.35,40.96 45.72,41.59 v45.72,45.72
SQW
  Bottom 0.61: U1.7 15.56,28.04 R16.1
TXD0  (via drill 0.38 pad 0.81, 0.4 pad 0.81)
  Top 0.305: v49.53,21.59 49.53,22.23 50.16,22.86 52.07,22.86 | 52.07,22.86 54.29,22.86 55.56,21.59 55.56,20.95 | R4.1 54.93,17.14 55.56,17.78 55.56,20.95 | 55.56,20.95 v56.2,20.95 | SJR1.16 77.28,20.2 75.25,22.23 75.25,22.54 73.03,24.77 68.26,24.77 67.31,23.81 67.31,21.27 v66.67,20.64 | 52.07,22.86 v52.07,24.13 | U2.35 73.39,60.28 72.39,61.28 62.87,61.28 v61.28,62.87 | v42.86,53.34 41.59,52.07 41.59,43.18 42.23,42.55 44.45,42.55 45.72,41.27 v45.72,39.05
  Bottom 0.305: R10.2 49.53,20.42 v49.53,21.59 | v56.2,20.95 56.2,21.27 63.18,21.27 63.82,20.64 v66.67,20.64 | v52.07,24.13 52.07,25.72 51.75,26.04 45.09,26.04 J1.2 45.09,35.56 45.72,36.2 v45.72,39.05 | v61.28,62.87 53.02,62.87 43.5,53.34 v42.86,53.34
TXD0_CP2101
  Top 0.305: R4.2 52.7,17.04 52.7,15.56 52.39,15.24 IC1.25
VBAT
  Bottom 0.61: U1.3 14.29,18.73 13.34,17.78 13.34,14.82 BT1.1
(copper drawn outside any net)
  shapes: Bottom area x6, Top area x6

### Text on the board
tNames: 3V3 | GND | +5V